# EAGLE design SparkFun_MicroMod_GNSS_Function_Board_ZED-F9P (EAGLE 9.6.2)
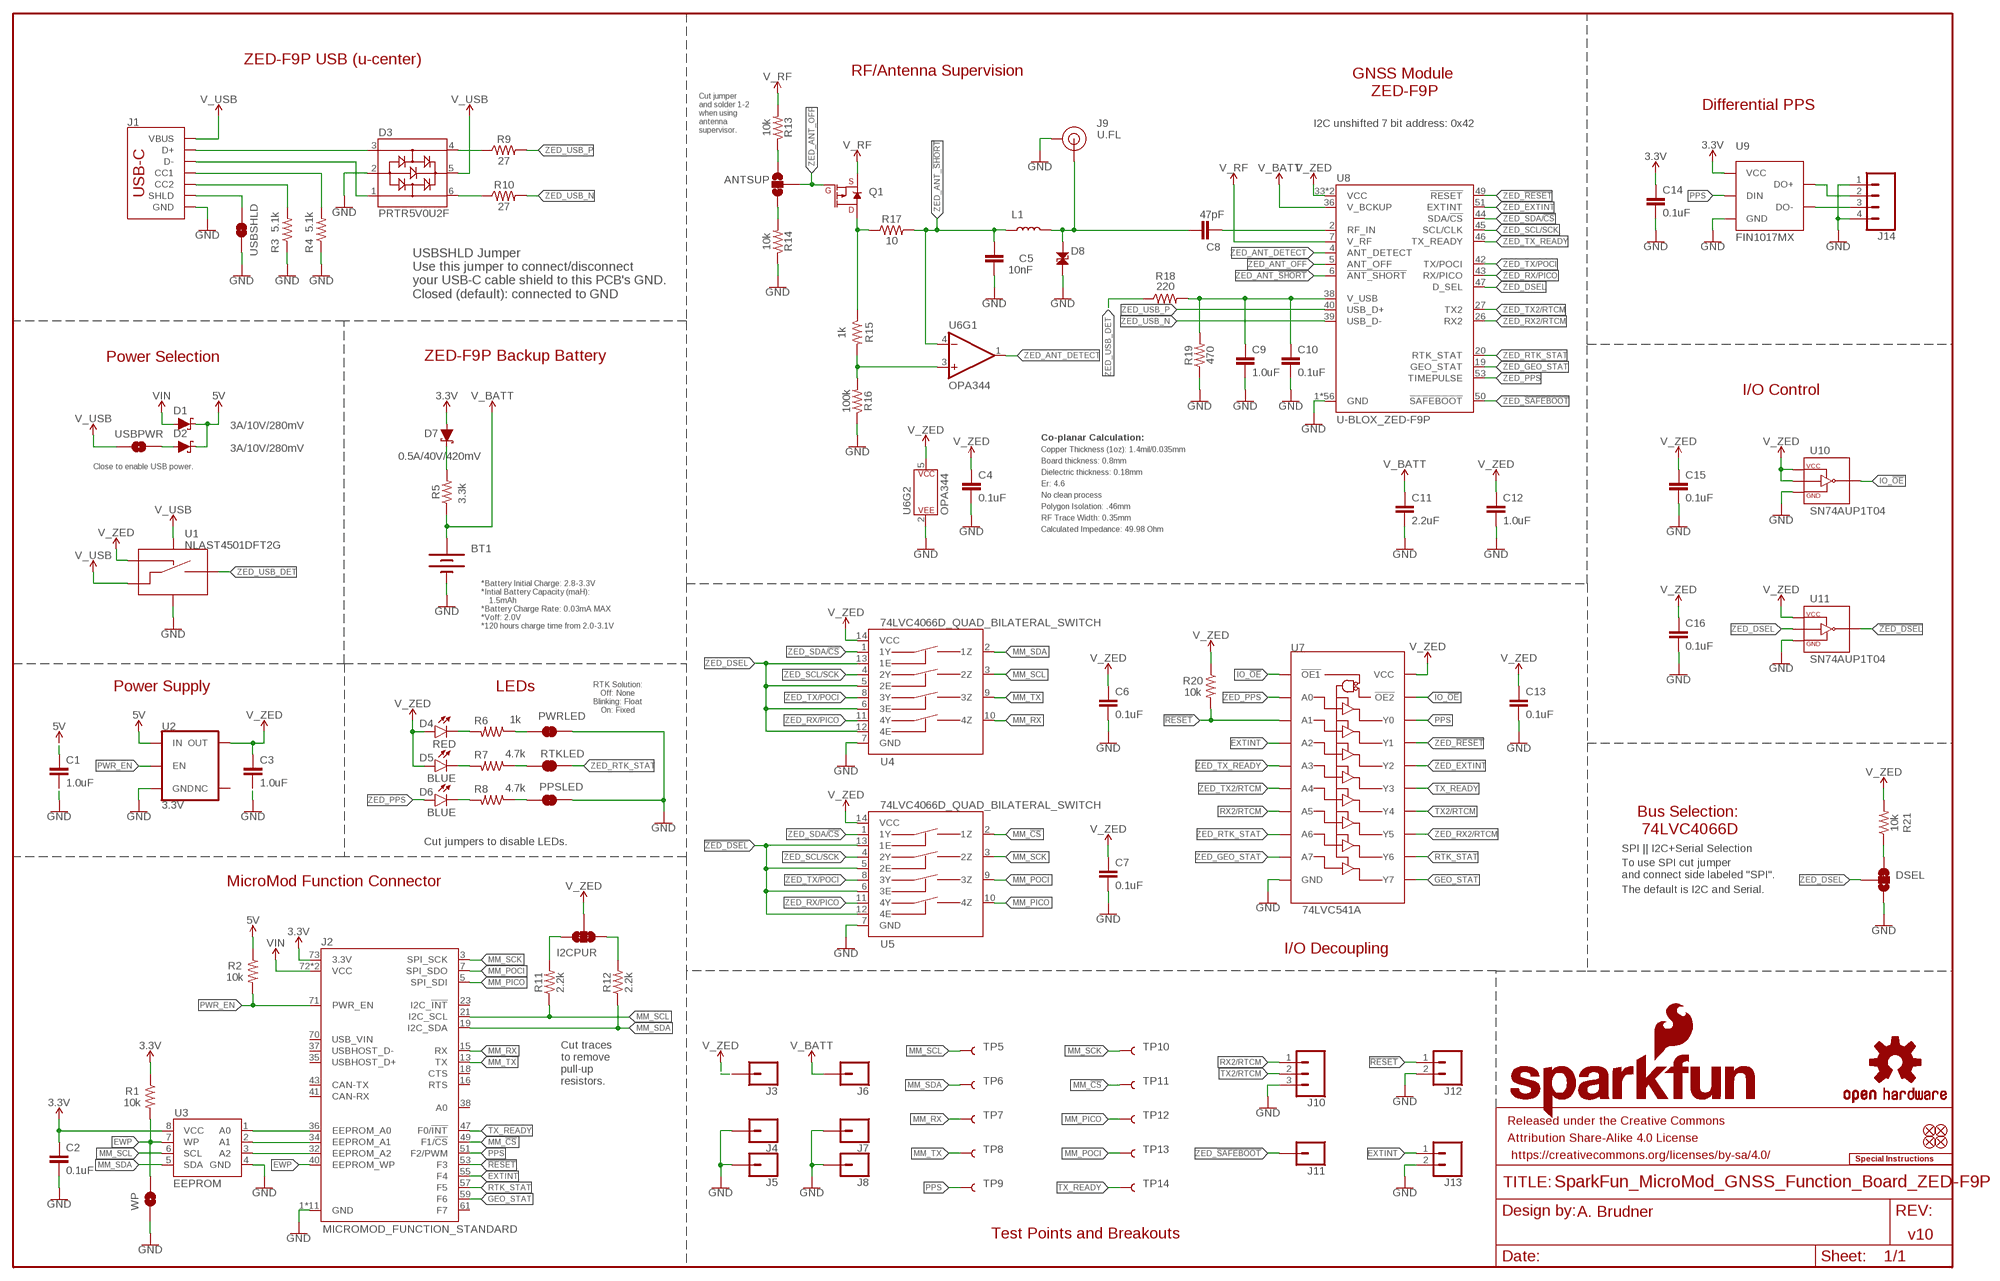
[diagram p0: schematic, sheet 1]

## Parts
ANTSUP  JUMPER-SMT_3_1-NC_TRACE_SILK  [SMT-JUMPER_3_1-NC_TRACE_SILK]
BT1  RELOWABLE_BATTERY_MS421R  [MS421R_IV03E]
C1  1.0uF  1.0UF-0402T-16V-10%  [0402-TIGHT]
C2  0.1uF  0.1UF-0402T-16V-10%  [0402-TIGHT]
C3  1.0uF  1.0UF-0402T-16V-10%  [0402-TIGHT]
C4  0.1uF  0.1UF-0402T-16V-10%  [0402-TIGHT]
C5  10nF  10NF-0402T-25V-10%-X7R-WE  [0402-TIGHT]
C6  0.1uF  0.1UF-0402T-16V-10%  [0402-TIGHT]
C7  0.1uF  0.1UF-0402T-16V-10%  [0402-TIGHT]
C8  47pF  CBR04C470J5GAC  [0402-TIGHT]
C9  1.0uF  1.0UF-0402T-16V-10%  [0402-TIGHT]
C10  0.1uF  0.1UF-0402T-16V-10%  [0402-TIGHT]
C11  2.2uF  2.2UF-0402_TIGHT-10V-10%-X5R  [0402-TIGHT]
C12  1.0uF  1.0UF-0402T-16V-10%  [0402-TIGHT]
C13  0.1uF  0.1UF-0402T-16V-10%  [0402-TIGHT]
C14  0.1uF  0.1UF-0402T-16V-10%  [0402-TIGHT]
C15  0.1uF  0.1UF-0402T-16V-10%  [0402-TIGHT]
C16  0.1uF  0.1UF-0402T-16V-10%  [0402-TIGHT]
D1  3A/10V/280mV  DIODE-SCHOTTKY-BAT60A  [SOD-323]
D2  3A/10V/280mV  DIODE-SCHOTTKY-BAT60A  [SOD-323]
D3  PRTR5V0U2F  [SOT886]
D4  RED  LED-RED0603  [LED-0603]
D5  BLUE  LED-BLUE0603  [LED-0603]
D6  BLUE  LED-BLUE0603  [LED-0603]
D7  0.5A/40V/420mV  DIODE-SCHOTTKY-PMEG4005EJ  [SOD-323]
D8  PESD0402-0402T  [0402-TIGHT]
DSEL  JUMPER-SMT_3_1-NC_TRACE_SILK  [SMT-JUMPER_3_1-NC_TRACE_SILK]
FD1  FIDUCIALUFIDUCIAL  [FIDUCIAL-MICRO]
FD2  FIDUCIALUFIDUCIAL  [FIDUCIAL-MICRO]
FD3  FIDUCIALUFIDUCIAL  [FIDUCIAL-MICRO]
FD4  FIDUCIALUFIDUCIAL  [FIDUCIAL-MICRO]
FRAME1  FRAME-LEDGER  [CREATIVE_COMMONS]
I2CPUR  JUMPER-SMT_3_2-NC_TRACE_SILK  [SMT-JUMPER_3_2-NC_TRACE_SILK]
J1  USB Female Type C Connector  USB_C_4-LAYER-ISOLATED  [USB-C-16P-4LAYER-ISOLATED]
J2  MICROMOD_FUNCTION_STANDARD  [M.2-CARD-E-22_FUNCTION_STANDARD]
J3  CONN_01PTH_NO_SILK_YES_STOP  [1X01_NO_SILK]
J4  CONN_01PTH_NO_SILK_YES_STOP  [1X01_NO_SILK]
J5  CONN_01PTH_NO_SILK_YES_STOP  [1X01_NO_SILK]
J6  CONN_01PTH_NO_SILK_SMALL  [1X01_SMALL]
J7  CONN_01PTH_NO_SILK_YES_STOP  [1X01_NO_SILK]
J8  CONN_01PTH_NO_SILK_YES_STOP  [1X01_NO_SILK]
J9  U.FL  U.FL2PIN  [U.FL]
J10  455-1750-1-ND  CONN_031X03_NO_SILK  [1X03_NO_SILK]
J11  CONN_01PTH_NO_SILK_YES_STOP  [1X01_NO_SILK]
J12  CONN_021X02_NO_SILK  [1X02_NO_SILK]
J13  CONN_021X02_NO_SILK  [1X02_NO_SILK]
J14  CONN_041X04_NO_SILK  [1X04_NO_SILK]
L1  150nH  LQW15AWR15J80D  [0402_MURATA]
LOGO1  SFE_LOGO_NAME_FLAMEBLANK  [BLANK]
LOGO2  SPECIAL_INSTRUCTIONS-ORDERING  [ORDERING_INSTRUCTIONS]
LOGO3  OSHW-LOGOMINI  [OSHW-LOGO-MINI]
PPSLED  JUMPER-SMT_2_NC_TRACE_SILK  [SMT-JUMPER_2_NC_TRACE_SILK]
PWRLED  JUMPER-SMT_2_NC_TRACE_SILK  [SMT-JUMPER_2_NC_TRACE_SILK]
Q1  DMP21D0UT-7  [SOT523]
R1  10k  10KOHM-0402T-1/16W-1%  [0402-TIGHT]
R2  10k  10KOHM-0402T-1/16W-1%  [0402-TIGHT]
R3  5.1k  5.1KOHM-0402T-1/16W-1%  [0402-TIGHT]
R4  5.1k  5.1KOHM-0402T-1/16W-1%  [0402-TIGHT]
R5  3.3K  3.3KOHM-0402T-1/16W-1%  [0402-TIGHT]
R6  1k  1KOHM-0402T-1/16W-1%  [0402-TIGHT]
R7  4.7k  4.7KOHM-0402T-1/16W-1%  [0402-TIGHT]
R8  4.7k  4.7KOHM-0402T-1/16W-1%  [0402-TIGHT]
R9  27  27OHM  [0402-TIGHT]
R10  27  27OHM  [0402-TIGHT]
R11  2.2k  2.2KOHM-0402T-1/16W-1%  [0402-TIGHT]
R12  2.2k  2.2KOHM-0402T-1/16W-1%  [0402-TIGHT]
R13  10k  10KOHM-0402T-1/16W-1%  [0402-TIGHT]
R14  10k  10KOHM-0402T-1/16W-1%  [0402-TIGHT]
R15  1k  1KOHM-0402T-1/16W-1%  [0402-TIGHT]
R16  100k  100KOHM-0402T-1/16W-1%  [0402-TIGHT]
R17  10  10OHM-0603-1/10W-1%  [0603]
R18  220  220OHM-0402-TIGHT-1/16W-1%  [0402-TIGHT]
R19  470  470OHM-0402-TIGHT-1/16W-1%  [0402-TIGHT]
R20  10k  10KOHM-0402T-1/16W-1%  [0402-TIGHT]
R21  10k  10KOHM-0402T-1/16W-1%  [0402-TIGHT]
RTKLED  JUMPER-SMT_2_NC_TRACE_SILK  [SMT-JUMPER_2_NC_TRACE_SILK]
TP5  TEST-POINT3  [PAD.03X.03]
TP6  TEST-POINT3  [PAD.03X.03]
TP7  TEST-POINT3  [PAD.03X.03]
TP8  TEST-POINT3  [PAD.03X.03]
TP9  TEST-POINT3  [PAD.03X.03]
TP10  TEST-POINT3  [PAD.03X.03]
TP11  TEST-POINT3  [PAD.03X.03]
TP12  TEST-POINT3  [PAD.03X.03]
TP13  TEST-POINT3  [PAD.03X.03]
TP14  TEST-POINT3  [PAD.03X.03]
U1  NLAST4501DFT2G  [SOT353]
U2  3.3V  V_REG_AP2112K-3.3V  [SOT23-5]
U3  EEPROM  EEPROM-I2C512K  [SO08]
U4  74LVC4066D_QUAD_BILATERAL_SWITCH  [SO14]
U5  74LVC4066D_QUAD_BILATERAL_SWITCH  [SO14]
U6  OPA344  [SOT23-5]
U7  74LVC541A  74LVC541ABQ  [DHVQFN20]
U8  U-BLOX_ZED-F9P  [ZED-F9P]
U9  FIN1017MX  [SO08]
U10  SN74AUP1T04  SN74AUP1T04DCK  [SC-70-5_DCK]
U11  SN74AUP1T04  SN74AUP1T04DCK  [SC-70-5_DCK]
USBPWR  JUMPER-SMT_2_NO_SILK  [SMT-JUMPER_2_NO_SILK]
USBSHLD  JUMPER-SMT_2_NC_TRACE_SILK  [SMT-JUMPER_2_NC_TRACE_SILK]
WP  JUMPER-SMT_2_NO_SILK  [SMT-JUMPER_2_NO_SILK]

## Nets
3.3V [3.3V]: C2.1 C14.1 D7.A J2.73(3.3V) R1.1 U3.8(VCC) U9.1(VCC)
5V [5V]: C1.1 D1.C D2.C R2.1 U2.1(IN)
!RESET! [DIGITAL]: J2.53(F3) J12.1 R20.2 U7.3(A1)
!ZED_DSEL! [ZED_DIG]: U5.5(2E) U5.6(3E) U5.12(4E) U5.13(1E) U11.4(Y)
A0 [DIGITAL]: J2.36(EEPROM_A0) U3.1(A0)
A1 [DIGITAL]: J2.34(EEPROM_A1) U3.2(A1)
A2 [DIGITAL]: J2.32(EEPROM_A2) U3.3(A2)
EWP [DIGITAL]: J2.40(EEPROM_WP) R1.2 U3.7(WP) WP.2
EXTINT [DIGITAL]: J2.55(F4) J13.1 U7.4(A2)
GEO_STAT [DIGITAL]: J2.59(F6) U7.11(Y7)
GND [GND]: BT1.- C1.2 C2.2 C3.2 C4.2 C5.2 C6.2 C7.2 C9.2 C10.2 C11.2 C12.2 C13.2 C14.2 C15.2 C16.2 D3.2 D8.2 DSEL.1 J1.GND J1.GND2(GND) J2.1(GND) J2.33(GND) J2.39(GND) J2.45(GND) J2.75(GND) J2.GND1(GND) J2.GND2(GND) J2.GND3(GND) J2.GND4(GND) J2.GND5(GND) J2.GND6(GND) J4.1 J5.1 J7.1 J8.1 J9.1(GND) J9.2(GND) J10.3 J12.2 J13.2 J14.1 J14.4 PPSLED.1 PWRLED.2 R3.1 R4.1 R14.1 R16.1 R19.1 U1.3(GND) U2.2(GND) U3.4(GND) U4.7(GND) U5.7(GND) U6.2(P$V-) U7.10(GND) U7.EPAD(GND) U8.1(GND) U8.3(GND) U8.12(GND) U8.14(GND) U8.32(GND) U8.37(GND) U8.41(GND) U8.48(GND) U8.55(GND) U8.56(GND) U8.57(GND) U8.58(GND) U8.59(GND) U8.60(GND) U8.61(GND) U8.62(GND) U8.63(GND) U8.64(GND) U8.65(GND) U8.66(GND) U8.67(GND) U8.68(GND) U8.69(GND) U8.70(GND) U8.71(GND) U8.72(GND) U8.73(GND) U8.74(GND) U8.75(GND) U8.76(GND) U8.77(GND) U8.78(GND) U8.79(GND) U8.80(GND) U8.81(GND) U8.82(GND) U8.83(GND) U8.84(GND) U8.85(GND) U8.86(GND) U8.87(GND) U8.88(GND) U8.89(GND) U8.90(GND) U8.91(GND) U8.92(GND) U8.93(GND) U8.94(GND) U8.95(GND) U8.96(GND) U8.97(GND) U8.98(GND) U8.99(GND) U8.100(GND) U8.101(GND) U8.102(GND) U9.4(GND) U10.3(GND) U11.3(GND) USBSHLD.2 WP.1
IO_!OE! [DIGITAL]: U7.1(!OE1!) U7.19(!OE2!) U10.4(Y)
MM_!CS! [DIGITAL]: J2.49(F1/!CS!) TP11.1 U5.2(1Z)
MM_PICO [DIGITAL]: J2.5(SPI_SDI) TP12.1 U5.10(4Z)
MM_POCI [DIGITAL]: J2.7(SPI_SDO) TP13.1 U5.9(3Z)
MM_RX [DIGITAL]: J2.15(RX) TP7.1 U4.10(4Z)
MM_SCK [DIGITAL]: J2.3(SPI_SCK) TP10.1 U5.3(2Z)
MM_SCL [DIGITAL]: J2.21(I2C_SCL) R11.1 TP5.1 U3.6(SCL) U4.3(2Z)
MM_SDA [DIGITAL]: J2.19(I2C_SDA) R12.1 TP6.1 U3.5(SDA) U4.2(1Z)
MM_TX [DIGITAL]: J2.13(TX) TP8.1 U4.9(3Z)
N$1: ANTSUP.1 R13.1
N$2: ANTSUP.3 R14.2
N$3: J1.B5(CC2) R3.2
N$4: J1.A5(CC1) R4.2
N$5: DSEL.3 R21.1
N$6: I2CPUR.3 R11.2
N$7 [RF_IN]: C8.1 D8.1 J9.FEED(SIGNAL) L1.2
N$8: R7.1 RTKLED.2
N$9: I2CPUR.1 R12.2
N$13: Q1.1(D) R15.1 R17.1
N$14 [3.3V]: C9.1 C10.1 R18.2 R19.2 U8.38(V_USB)
N$16 [5V]: D2.A USBPWR.2
N$26: PWRLED.1 R6.1
N$27: PPSLED.2 R8.1
N$28: D6.C R8.2
N$29: D5.C R7.2
N$30: D4.C R6.2
N$32 [3.3V]: D7.C R5.2
N$48: R15.2 R16.2 U6.3(+IN)
PPS [DIGITAL]: J2.51(F2/PWM) TP9.1 U7.18(Y0) U9.2(DIN)
PPS_DIFF_N [PPS_DIFF]: J14.3 U9.8(DO-)
PPS_DIFF_P [PPS_DIFF]: J14.2 U9.7(DO+)
PWR_EN [DIGITAL]: J2.71(PWR_EN) R2.2 U2.3(EN)
RF_IN [RF_IN]: C8.2 U8.2(RF_IN)
RTK_STAT [DIGITAL]: J2.57(F5) U7.12(Y6)
RX2/RTCM [DIGITAL]: J10.1 U7.7(A5)
SHLD: J1.SHLD1(SHLD) J1.SHLD2(SHLD) J1.SHLD3(SHLD) J1.SHLD4(SHLD) J1.SHLD5(SHLD) J1.SHLD6(SHLD) J1.SHLD7(SHLD) J1.SHLD8(SHLD) USBSHLD.1
TX2/RTCM [DIGITAL]: J10.2 U7.14(Y4)
TX_READY [DIGITAL]: J2.47(F0/!INT!) TP14.1 U7.15(Y3)
USB_N [USB_DIFF]: D3.6 R10.1
USB_P [USB_DIFF]: D3.4 R9.1
USBC_N [USB_DIFF]: D3.1 J1.A7(D-) J1.B7(D-)
USBC_P [USB_DIFF]: D3.3 J1.A6(D+) J1.B6(D+)
V_BATT [5V]: BT1.+ C11.1 J6.P$1 R5.1 U8.36(V_BCKUP)
V_RF [V_RF]: Q1.2(S) R13.2 U8.7(V_RF)
V_USB [5V]: D3.5 J1.VBUS1(VBUS) J1.VBUS2(VBUS) U1.1(COM) U1.5(VCC) USBPWR.1
V_ZED [V_ZED]: C3.1 C4.1 C6.1 C7.1 C12.1 C13.1 C15.1 C16.1 D4.A D5.A I2CPUR.2 J3.1 R20.1 R21.2 U1.4(EN) U2.5(OUT) U4.14(VCC) U5.14(VCC) U6.5(P$V+) U7.20(VCC) U8.33(VCC) U8.34(VCC) U10.2(A) U10.5(VCC) U11.5(VCC)
VIN [5V]: D1.A J2.72(VCC) J2.74(VCC)
ZED_!RESET! [ZED_DIG]: U7.17(Y1) U8.49(!RESET!)
ZED_!SAFEBOOT! [ZED_DIG]: J11.1 U8.50(!SAFEBOOT!)
ZED_ANT_!SHORT! [ZED_DIG]: C5.1 L1.1 R17.2 U6.4(-IN) U8.6(!ANT_SHORT!)
ZED_ANT_DETECT [ZED_DIG]: U6.1(OUT) U8.4(ANT_DETECT)
ZED_ANT_OFF [ZED_DIG]: ANTSUP.2 Q1.3(G) U8.5(ANT_OFF)
ZED_DSEL [ZED_DIG]: DSEL.2 U4.5(2E) U4.6(3E) U4.12(4E) U4.13(1E) U8.47(D_SEL) U11.2(A)
ZED_EXTINT [ZED_DIG]: U7.16(Y2) U8.51(EXTINT)
ZED_GEO_STAT [ZED_DIG]: U7.9(A7) U8.19(GEO_STAT)
ZED_PPS [ZED_DIG]: D6.A U7.2(A0) U8.53(TIMEPULSE)
ZED_RTK_STAT [ZED_DIG]: RTKLED.1 U7.8(A6) U8.20(RTK_STAT)
ZED_RX2/RTCM [ZED_DIG]: U7.13(Y5) U8.26(RX2)
ZED_RX/PICO [ZED_DIG]: U4.11(4Y) U5.11(4Y) U8.43(RX/PICO)
ZED_SCL/SCK [ZED_DIG]: U4.4(2Y) U5.4(2Y) U8.45(SCL/CLK)
ZED_SDA/!CS! [ZED_DIG]: U4.1(1Y) U5.1(1Y) U8.44(SDA/!CS!)
ZED_TX2/RTCM [ZED_DIG]: U7.6(A4) U8.27(TX2)
ZED_TX/POCI [ZED_DIG]: U4.8(3Y) U5.8(3Y) U8.42(TX/POCI)
ZED_TX_READY [ZED_DIG]: U7.5(A3) U8.46(TX_READY)
ZED_USB_DET: R18.1 U1.2(NO)
ZED_USB_N [USB_DIFF]: R10.2 U8.39(USB_D-)
ZED_USB_P [USB_DIFF]: R9.2 U8.40(USB_D+)
Unconnected: J2.16(RTS) J2.18(CTS) J2.23(I2C_!INT!) J2.35(USBHOST_D+) J2.37(USBHOST_D-) J2.38(A0) J2.41(CAN-RX) J2.43(CAN-TX) J2.61(F7) J2.70(USB_VIN) U2.4(NC)

## Notes on the sheet
- ZED-F9P USB (u-center)
- RF/Antenna Supervision
- GNSS Module 
  ZED-F9P
- Differential PPS
- I2C unshifted 7 bit address: 0x42
- Cut jumper 
  and solder 1-2 
  when using 
  antenna 
  supervisor.
- USBSHLD Jumper
  Use this jumper to connect/disconnect
  your USB-C cable shield to this PCB's GND.
  Closed (default): connected to GND
- Power Selection | ZED-F9P Backup Battery
- I/O Control
- Co-planar Calculation:
- Copper Thickness (1oz): 1.4mil/0.035mm
- Board thickness: 0.8mm
- Close to enable USB power.
- Dielectric thickness: 0.18mm
- Er: 4.6
- No clean process
- Polygon Isolation: .46mm
- RF Trace Width: 0.35mm
- Calculated Impedance: 49.98 Ohm
- *Battery Initial Charge: 2.8-3.3V
  *Intial Battery Capacity (maH): 
      1.5mAh
  *Battery Charge Rate: 0.03mA MAX
  *Voff: 2.0V
  *120 hours charge time from 2.0-3.1V
- Power Supply | LEDs
- RTK Solution:
  Off: None
  Blinking: Float
  On: Fixed
- Bus Selection: 
  74LVC4066D
- Cut jumpers to disable LEDs.
- SPI || I2C+Serial Selection
- To use SPI cut jumper
  and connect side labeled "SPI".
- MicroMod Function Connector
- The default is I2C and Serial.
- I/O Decoupling
- Cut traces 
  to remove 
  pull-up 
  resistors.
- A. Brudner
- Test Points and Breakouts
- v10

## Library data of the parts
ANTSUP DSEL = SparkFun-Jumpers:JUMPER-SMT_3_1-NC_TRACE: Normally closed trace jumper (1 of 2 connections) This jumper has a trace between two pads so it's normally closed (NC). The other connection is normally open (NO). Use a razor knife to open the connection. For best results follow the IPC guidelines for cutting traces: Cutout at least 0.063 mm (0.005 in). Remove all loose material to clean up the cut area. Seal the cut with an approved epoxy. Reapply solder to reclose the connection, or to close the NO connection.
BT1 = SparkFun-Batteries:RELOWABLE_BATTERY: SEIKO Reflowable Lithium Batteries; PROD_ID: BAT-16685
C1 C3 C9 C12 = SparkFun-Capacitors:1.0UF: 1µF ceramic capacitors A capacitor is a passive two-terminal electrical component used to store electrical energy temporarily in an electric field.; PROD_ID: CAP-12417
C2 C4 C6 C7 C10 C13-C16 = SparkFun-Capacitors:0.1UF: 0.1µF ceramic capacitors A capacitor is a passive two-terminal electrical component used to store electrical energy temporarily in an electric field.; PROD_ID: CAP-12416
C5 = SparkFun-Capacitors:10NF: 0.01uF/10nF/10,000pF ceramic capacitors A capacitor is a passive two-terminal electrical component used to store electrical energy temporarily in an electric field. CAP-09321; PROD_ID: CAP-16508
C8 = SparkFun_MicroMod_GNSS_Function_Board_ZED-F9P:CBR04C470J5GAC: Kemet CBR04C470J5GAC - 47pF 5% 50V 0402 Capacitor KEMET’s HiQ CBR RF Capacitor Series features a copper electrode BME (Base Metal Electrode) system that offers ultra-low ESR and High Q in the VHF, UHF, and microwave frequency bands. Low ESR allows for higher RF currents which are ideal for applications such as cellular base stations and telecommunication networks. CBR Series capacitors exhibit no change in capacitance with respect to time and voltage, and boast a negligible change in capacitance with reference to ambient temperature. SparkFun Products: SparkFun MicroMod Function Board ZED-F9P; CAPACITANCE: 47pF; PROD_ID: CAP-16699; TOLERANCE: 5%; VOLTAGE: 50V
C11 = SparkFun-Capacitors:2.2UF: 2.2µF ceramic capacitors A capacitor is a passive two-terminal electrical component used to store electrical energy temporarily in an electric field.; PROD_ID: CAP-14232
D1 D2 = SparkFun-DiscreteSemi:DIODE-SCHOTTKY: Schottky diode A Schottky diode is a semiconductor diode which has a low forward voltage drop and a very fast switching action.; PROD_ID: DIO-14072
D3 = SparkFun-IC-Power:PRTR5V0U2: A small ESD protection device. Most commonly used on USB D+/D- signals to protect large, expensive, or especially sensitive USB enabled devices.; PROD_ID: DIO-14084
D4 = SparkFun-LED:LED-RED: Red SMD LED Used in manufacturing of most products at SparkFun Packages: 0603 - SMD 0603 package [Product Link] <http://docs.avagotech.com/docs/AV02-0551EN> 0603 SMART - SMD 0603 SMART package ( more efficient and expensive)[Product Link] <http://www.osram-os.com/Graphics/XPic2/00077099_0.pdf> 1206 - SMD1206 package [Product Link] <https://www.sparkfun.com/datasheets/DevTools/LilyPad/Q150OVS4.pdff> SparkFun Products: Pro Mini 328 -5V <https://www.sparkfun.com/products/821> RedBoard <https://www.sparkfun.com/products/12757> IOIO-OTG <https://www.sparkfun.com/products/13613>; PROD_ID: DIO-00819
D5 D6 = SparkFun-LED:LED-BLUE: Blue SMD LED Used in manufacturing of various products at SparkFun Packages: 0603 - SMD 0603 package [Product Link] <http://www.digikey.com/product-detail/en/SMLE12BC7TT86/511-1589-2-ND/1641808> 1206 - SMD1206 package [Product Link] <http://www.digikey.com/product-detail/en/lite-on-inc/LTST-C150TBKT/160-1643-1-ND/573584> SparkFun Products: ESP8266 Thing-Dev Board <https://www.sparkfun.com/products/13711> RedBoard <https://www.sparkfun.com/products/12757>; PROD_ID: DIO-08575
D7 = SparkFun-DiscreteSemi:DIODE-SCHOTTKY: Schottky diode A Schottky diode is a semiconductor diode which has a low forward voltage drop and a very fast switching action.; PROD_ID: DIO-10955
D8 = SparkFun-DiscreteSemi:PESD0402: ESD protection diode PESD is used to protect a signal line from ESD.; PROD_ID: DIO-15359
FD1-FD4 = SparkFun-Aesthetics:FIDUCIAL: Fiducial Alignment Points Point-of-reference for pick-and-place machines and other optical instruments.
FRAME1 = SparkFun-Aesthetics:FRAME-LEDGER: Schematic Frame - Ledger Standard 11x14 US Ledger frame
I2CPUR = SparkFun-Jumpers:JUMPER-SMT_3_2-NC_TRACE: Normally closed trace jumper (2 of 2 connections) This jumper has a trace between all three pads so they are normally closed (NC). Use a razor knife to open the connection(s). For best results follow the IPC guidelines for cutting traces: Cutout at least 0.063 mm (0.005 in). Remove all loose material to clean up the cut area. Seal the cut with an approved epoxy. Reapply solder to reclose the connection(s).
J1 = SparkFun-Connectors:USB_C: USB Type C 16Pin Connector Super Speed pins not available on the 16-pin purely SMD connector so this part is best for USB 2.0 implementations. D1 and D2 are tied together enabling D+/- no matter which way the cable is plugged into the connector. The two channel configuration pins (CC1/2) are exposed. These are normally connected to ground via 5.1k resistors but can be reconfigured for high current/high power applications. **4-LAYER BOARD WARNING!!** If designing 4-layer board, make sure to select the variant _4-LAYER-ISOLATED. The linked footprint (USB-C-16-4LAYER-ISOLATED) includes some very necessary cutout polygons in the inner layers (2 and 15). This prevents the PTH mounting shield legs on the USB connector from electrically connecting any other polygons on the inner layers (usually VCC and GND).; PROD_ID: CONN-14122
J2 = SparkFun-MicroMod:MICROMOD_FUNCTION: MicroMod Connector Description: A card edge connector and mating PCB connector to allow various MicroMod Processor Boards to be coupled with various carrier boards of different capabilities. Based on the M.2 standard.
J3-J8 J11 = SparkFun-Connectors:CONN_01: Single connection point. Often used as Generic Header-pin footprint for 0.1 inch spaced/style header connections On any of the 0.1 inch spaced packages, you can populate with these: Break Away Headers - Straight <https://www.sparkfun.com/products/116> (PRT-00116) Break Away Male Headers - Right Angle <https://www.sparkfun.com/products/553> (PRT-00553) Female Headers <https://www.sparkfun.com/products/115> (PRT-00115) Break Away Headers - Machine Pin <https://www.sparkfun.com/products/117> (PRT-00117) Break Away Female Headers - Swiss Machine Pin <https://www.sparkfun.com/products/743> (PRT-00743) This device is also useful as a general connection point to wire up your design to another part of your project. Our various solder wires solder well into these plated through hole pads. Hook-Up Wire - Assortment (Stranded, 22 AWG) <https://www.sparkfun.com/products/11375> (PRT-11375) Hook-Up Wire - Assortment (Solid Core, 22 AWG) <https://www.sparkfun.com/products/11367> (PRT-11367) View the entire wire category on our website here <https://www.sparkfun.com/categories/141> Special notes: SMTSO-256-ET is a "flush mount" nut for a 4-40 screw. We mostly use this on specialty testbeds; it is a nice way to connect hardware to your PCB at an adjustable hieght. Also note, the SNAP packages are for using a snappable style connector. We sell a baggie of snaps and they are also used on two LilyPad designs: Snap Assortment - 30 pack (male and female) <https://www.sparkfun.com/products/11347> (DEV-11347) LilyPad Arduino SimpleSnap <https://www.sparkfun.com/products/10941> (DEV-10941) LilyPad SimpleSnap Protoboard <https://www.sparkfun.com/products/10940> (DEV-10940)
J9 = SparkFun-Connectors:U.FL2PIN: SMD Antenna Connector - U.FL 2mm height, 3.0mm x 3.0mm receptacle size. SparkFun Products: SparkFun WiFi Shield - ESP8266 <https://www.sparkfun.com/products/13287> SparkFun ESP8266 Thing <https://www.sparkfun.com/products/13231> SparkFun MiniGen - Pro Mini Signal Generator Shield <https://www.sparkfun.com/products/11420>; PROD_ID: CONN-09193; SF_ID: WRL-09144
J10 = SparkFun-Connectors:CONN_03: Multi connection point. Often used as Generic Header-pin footprint for 0.1 inch spaced/style header connections On any of the 0.1 inch spaced packages, you can populate with these: Break Away Headers - Straight <https://www.sparkfun.com/products/116> (PRT-00116) Break Away Male Headers - Right Angle <https://www.sparkfun.com/products/553> (PRT-00553) Female Headers <https://www.sparkfun.com/products/115> (PRT-00115) Break Away Headers - Machine Pin <https://www.sparkfun.com/products/117> (PRT-00117) Break Away Female Headers - Swiss Machine Pin <https://www.sparkfun.com/products/743> (PRT-00743) Stackable Header - 3 Pin (Female, 0.1") <https://www.sparkfun.com/products/13875> (PRT-13875) For SCREWTERMINALS and SPRING TERMINALS visit here: Screw Terimnals on SparkFun.com <https://www.sparkfun.com/search/results?term=Screw+Terminals> (5mm/3.5mm/2.54mm spacing) This device is also useful as a general connection point to wire up your design to another part of your project. Our various solder wires solder well into these plated through hole pads. Hook-Up Wire - Assortment (Stranded, 22 AWG) <https://www.sparkfun.com/products/11375> (PRT-11375) Hook-Up Wire - Assortment (Solid Core, 22 AWG) <https://www.sparkfun.com/products/11367> (PRT-11367) View the entire wire category on our website here <https://www.sparkfun.com/categories/141> Special notes: Molex polarized connector foot print use with SKU : PRT-08232 with associated crimp pins and housings.
J12 J13 = SparkFun-Connectors:CONN_02: Multi connection point. Often used as Generic Header-pin footprint for 0.1 inch spaced/style header connections On any of the 0.1 inch spaced packages, you can populate with these: Break Away Headers - Straight <https://www.sparkfun.com/products/116> (PRT-00116) Break Away Male Headers - Right Angle <https://www.sparkfun.com/products/553> (PRT-00553) Female Headers <https://www.sparkfun.com/products/115> (PRT-00115) Break Away Headers - Machine Pin <https://www.sparkfun.com/products/117> (PRT-00117) Break Away Female Headers - Swiss Machine Pin <https://www.sparkfun.com/products/743> (PRT-00743) For SCREWTERMINALS and SPRING TERMINALS visit here: Screw Terimnals on SparkFun.com <https://www.sparkfun.com/search/results?term=Screw+Terminals> (5mm/3.5mm/2.54mm spacing) This device is also useful as a general connection point to wire up your design to another part of your project. Our various solder wires solder well into these plated through hole pads. Hook-Up Wire - Assortment (Stranded, 22 AWG) <https://www.sparkfun.com/products/11375> (PRT-11375) Hook-Up Wire - Assortment (Solid Core, 22 AWG) <https://www.sparkfun.com/products/11367> (PRT-11367) View the entire wire category on our website here <https://www.sparkfun.com/categories/141> Special notes: Molex polarized connector foot print use with: PRT-08233 with associated crimp pins and housings. 2.54_SCREWTERM for use with PRT-10571. 3.5mm Screw Terminal footprints for PRT-08084 5mm Screw Terminal footprints for use with PRT-08432
J14 = SparkFun-Connectors:CONN_04: Multi connection point. Often used as Generic Header-pin footprint for 0.1 inch spaced/style header connections On any of the 0.1 inch spaced packages, you can populate with these: Break Away Headers - Straight <https://www.sparkfun.com/products/116> (PRT-00116) Break Away Male Headers - Right Angle <https://www.sparkfun.com/products/553> (PRT-00553) Female Headers <https://www.sparkfun.com/products/115> (PRT-00115) Break Away Headers - Machine Pin <https://www.sparkfun.com/products/117> (PRT-00117) Break Away Female Headers - Swiss Machine Pin <https://www.sparkfun.com/products/743> (PRT-00743) For SCREWTERMINALS and SPRING TERMINALS visit here: Screw Terimnals on SparkFun.com <https://www.sparkfun.com/search/results?term=Screw+Terminals> (5mm/3.5mm/2.54mm spacing) This device is also useful as a general connection point to wire up your design to another part of your project. Our various solder wires solder well into these plated through hole pads. Hook-Up Wire - Assortment (Stranded, 22 AWG) <https://www.sparkfun.com/products/11375> (PRT-11375) Hook-Up Wire - Assortment (Solid Core, 22 AWG) <https://www.sparkfun.com/products/11367> (PRT-11367) View the entire wire category on our website here <https://www.sparkfun.com/categories/141> Special notes: Molex polarized connector foot print use with SKU : PRT-08231 with associated crimp pins and housings. 1MM SMD Version SKU: PRT-10208; PROD_ID: CONN-09696
L1 = SparkFun_MicroMod_GNSS_Function_Board_ZED-F9P:LQW15AWR15J80D: Murata LQW15AW_08 series- 0402 Chip Inductors Chip Inductor SparkFun Products: SparkFun MicroMod u-blox ZED-F9P Function Board; CURRENT: 280mA; DCRESISTANCE: 1.71Ohm; PROD_ID: NDUC-16702
LOGO1 = SparkFun-Aesthetics:SFE_LOGO_NAME_FLAME: SparkFun Font Logo w/ Flame This is the SparkFun full logo. The logo on the schematic will always be the same size; the package variant is the height of the flame part of the logo. Default layer for the logo on the board is tSilk.
LOGO2 = SparkFun-Aesthetics:SPECIAL_INSTRUCTIONS: Special Ordering/Production Instructions Alert Symbol for special PCB ordering instructions or unique production process warnings. Ordering Instructions Production Instructions Types of information that should be added to box: Copper weight Soldermask color Silk color PCB thickness Number of layers PCB Standard: 1.6mm FR4 1 oz copper immersion silver plating red soldermask white silkscreen Types of information that should be added to box: Special wash requirements Depaneling instructions Humidification Glue curing Default text settings: 0.07 inch 9% ratio 50% line distance
LOGO3 = SparkFun-Aesthetics:OSHW-LOGO: Open-Source Hardware (OSHW) Logo This logo indicates the piece of hardware it is found on incorporates a OSHW license and/or adheres to the definition of open source hardware found here: http://freedomdefined.org/OSHW
PPSLED PWRLED RTKLED USBSHLD = SparkFun-Jumpers:JUMPER-SMT_2_NC_TRACE: Normally closed trace jumper This jumper has a trace between two pads so it's normally closed (NC). Use a razor knife to open the connection. For best results follow the IPC guidelines for cutting traces: Cutout at least 0.063 mm (0.005 in). Remove all loose material to clean up the cut area. Seal the cut with an approved epoxy. Reapply solder to reclose the connection.
Q1 = SparkFun_MicroMod_GNSS_Function_Board_ZED-F9P:DMP21D0UT: Diodes Inc. DMP21D0UT - 20V P-CHANNEL ENHANCEMENT MODE MOSFET This MOSFET has been designed to minimize the on-state resistance (R_DS(on)) and yet maintain superior switching performance, making it ideal for high efficiency power management applications. SparkFun Products: SparkFun MicroMod u-blox ZED-F9P Function Board; I_D: 590mA; PROD_ID: TRANS-16700; V_DSS: -20V
R1 R2 R13 R14 R20 R21 = SparkFun-Resistors:10KOHM: 10kΩ resistor A resistor is a passive two-terminal electrical component that implements electrical resistance as a circuit element. Resistors act to reduce current flow, and, at the same time, act to lower voltage levels within circuits. - Wikipedia; PROD_ID: RES-14241
R3 R4 = SparkFun-Resistors:5.1KOHM; PROD_ID: RES-14340
R5 = SparkFun-Resistors:3.3KOHM: 3.3kΩ resistor A resistor is a passive two-terminal electrical component that implements electrical resistance as a circuit element. Resistors act to reduce current flow, and, at the same time, act to lower voltage levels within circuits. - Wikipedia; PROD_ID: RES-15923; RES: 3.3k
R6 = SparkFun-Resistors:1KOHM: 1kΩ resistor A resistor is a passive two-terminal electrical component that implements electrical resistance as a circuit element. Resistors act to reduce current flow, and, at the same time, act to lower voltage levels within circuits. - Wikipedia; PROD_ID: RES-14342
R7 R8 = SparkFun-Resistors:4.7KOHM: 4.7kΩ resistor A resistor is a passive two-terminal electrical component that implements electrical resistance as a circuit element. Resistors act to reduce current flow, and, at the same time, act to lower voltage levels within circuits. - Wikipedia; PROD_ID: RES-15343
R9 R10 = SparkFun-Resistors:27OHM: 27Ω resistor A resistor is a passive two-terminal electrical component that implements electrical resistance as a circuit element. Resistors act to reduce current flow, and, at the same time, act to lower voltage levels within circuits. - Wikipedia; PROD_ID: RES-15238
R11 R12 = SparkFun-Resistors:2.2KOHM: 2.2kΩ resistor A resistor is a passive two-terminal electrical component that implements electrical resistance as a circuit element. Resistors act to reduce current flow, and, at the same time, act to lower voltage levels within circuits. - Wikipedia; PROD_ID: RES-14341
R15 = SparkFun-Resistors:1KOHM: 1kΩ resistor A resistor is a passive two-terminal electrical component that implements electrical resistance as a circuit element. Resistors act to reduce current flow, and, at the same time, act to lower voltage levels within circuits. - Wikipedia; PROD_ID: RES-14342; RESISTANCE: 1k
R16 = SparkFun-Resistors:100KOHM: 100kΩ resistor A resistor is a passive two-terminal electrical component that implements electrical resistance as a circuit element. Resistors act to reduce current flow, and, at the same time, act to lower voltage levels within circuits. - Wikipedia; PROD_ID: RES-13495
R17 = SparkFun-Resistors:10OHM: 10Ω resistor A resistor is a passive two-terminal electrical component that implements electrical resistance as a circuit element. Resistors act to reduce current flow, and, at the same time, act to lower voltage levels within circuits. - Wikipedia; PROD_ID: RES-12581
R18 = SparkFun-Resistors:220OHM: 220Ω resistor A resistor is a passive two-terminal electrical component that implements electrical resistance as a circuit element. Resistors act to reduce current flow, and, at the same time, act to lower voltage levels within circuits. - Wikipedia; PROD_ID: RES-15269
R19 = SparkFun-Resistors:470OHM: 470Ω resistor A resistor is a passive two-terminal electrical component that implements electrical resistance as a circuit element. Resistors act to reduce current flow, and, at the same time, act to lower voltage levels within circuits. - Wikipedia; PROD_ID: RES-15584
TP5-TP14 = SparkFun-Connectors:TEST-POINT: SparkFun Test Points Bare copper test points for troubleshooting or In-Circuit-Testing. These are used by our Production team for verifying production board runs using pogo-pins on test beds. SparkFun Products: SparkFun LSM9DS1 Breakout <https://www.sparkfun.com/products/13284> SparkFun PSOC <https://www.sparkfun.com/products/13714> SparkFun Load Cell Amplifier <https://www.sparkfun.com/products/13879>
U1 = SparkFun_MicroMod_GNSS_Function_Board_ZED-F9P:NLAST4501; PROD_ID: IC-16759
U2 = SparkFun-IC-Power:V_REG_AP2112: AP2112 - 600mA CMOS LDO Regulator w/ Enable The AP2112 is CMOS process low dropout linear regulator with enable function, the regulator delivers a guaranteed 600mA (min.) continuous load current. Features Output Voltage Accuracy: ±1.5% Output Current: 600mA (Min.) Foldback Short Current Protection: 50mA Enable Function to Turn ON/OFF VOUT Low Dropout Voltage (3.3V): 250mV (Typ.) @IOUT=600mA Excellent Load Regulation: 0.2%/A (Typ.) Excellent Line Regulation: 0.02%/V (Typ.) Low Quiescent Current: 55μA (Typ.) Low Standby Current: 0.01μA (Typ.) Low Output Noise: 50μVRMS PSRR: 100Hz -65dB, 1kHz -65dB OTSD Protection Stable with 1.0μF Flexible Cap: Ceramic, Tantalum and Aluminum Electrolytic Operation Temperature Range: -40°C to 85°C ESD: MM 400V, HBM 4000V; PROD_ID: VREG-12457
U3 = SparkFun-IC-Memory:EEPROM-I2C: I2C EEPROMs, 24LC256 and others 24LC256 Series 256 kb I2C 2 Wire (32 k x 8 Bit) 2.5 V Serial EEPROM SMD - SOIC-8 Datasheet SparkFun Products SparkFun UDB5 - PIC UAV Development Board <https://www.sparkfun.com/products/11703> (GPS-11703); PROD_ID: IC-14645
U4 U5 = SparkFun-IC-Logic:74LVC4066D_QUAD_BILATERAL_SWITCH: Nexperia Quad Bilateral Switch The 74LVC4066 is a high-speed Si-gate CMOS device. The 74LVC4066 provides four single pole, single-throw analog switch functions. Each switch has two input/output terminals (nY and nZ) and an active HIGH enable input (nE). When nE is LOW, the analog switch is turned off. Schmitt-trigger action at the enable inputs makes the circuit tolerant of slower input rise and fall times across the entire VCC range from 1.65 V to 5.5 V. Datasheet <https://assets.nexperia.com/documents/data-sheet/74LVC4066.pdf>; PROD_ID: IC-13944
U6 = SparkFun-IC-Amplifiers:OPA344: Single gate rail-to-rail output op-amp. Inputs extend 300mV past rails. Datasheet <http://www.ti.com/product/OPA344> SparkFun Products SparkFun Low Current Sensor <https://www.sparkfun.com/products/8883> (SEN-08883) SparkFun Electret Microphone Breakout <https://www.sparkfun.com/products/12758> (BOB-12758); PROD_ID: IC-08251
U7 = SparkFun_MicroMod_GNSS_Function_Board_ZED-F9P:74LVC541A: 74LVC541A IC OCTAL BUFFER, SCHMITT TRIGGER The 74LVC541A is an 8-bit buffer/line driver with 3-state outputs. The device features two output enables (OE1 and OE2). A HIGH on OEn causes the associated outputs to assume a high-impedance OFF-state . Inputs can be driven from either 3.3 V or 5 V devices. This feature allows the use of these devices as translators in mixed 3.3 V and 5 V environments. SparkFun Products: MicroMod Function u-blox ZED-F9P board; PROD_ID: IC-16698
U8 = SparkFun_MicroMod_GNSS_Function_Board_ZED-F9P:U-BLOX_ZED-F9P; PROD_ID: IC-14209
U9 = SparkFun_MicroMod_GNSS_Function_Board_ZED-F9P:FIN1017: OnSemi FIN1017 - 3.3V LVDS, 1-Bit, High-Speed Differential Driver This single driver is designed for high-speed interconnects utilizing Low Voltage Differential Signaling (LVDS) technology. The driver translates LVTTL signal levels to LVDS levels with a typical differential output swing of 350mV, which provides low EMI at ultra-low power dissipation even at high frequencies. This device is ideal for high-speed transfer of clock or data. SparkFun Products: SparkFun MicroMod u-blox ZED-F9P Function Board; PROD_ID: IC-16701
U10 U11 = SparkFun_MicroMod_GNSS_Function_Board_ZED-F9P:SN74AUP1T04: Texas Instruments SN74AUP1T04 - Single Inverter Gate The SN74AUP1T04 performs the Boolean function Y = !A! with designation for logic-level translation applications with output referenced to supply VCC. AUP technology is the industry's lowest-power logic technology designed for use in extending battery-life in operating. All input levels that accept 1.8-V LVCMOS signals, while operating from either a single 3.3-V or 2.5-V VCC supply. This product also maintains excellent signal integrity. The wide VCC range of 2.3 V to 3.6 V allows the possibility of switching output level to connect to external controllers or processors. Schmitt-trigger inputs (ΔVT = 210 mV between positive and negative input transitions) offer improved noise immunity during switching transitions, which is especially useful on analog mixed-mode designs. Schmitt-trigger inputs reject input noise, ensure integrity of output signals, and allow for slow input signal transition. SparkFun Products: SparkFun MicroMod u-blox ZED-F9P Function Board; PROD_ID: IC-16703
USBPWR WP = SparkFun-Jumpers:JUMPER-SMT_2_NO: Normally open jumper This jumper has two pads in close proximity to each other. Apply solder to close the connection. Round pads are easier to solder for beginners, but are a lot larger. SparkFun Product that uses the round pads: SparkFun EL Sequencer <https://www.sparkfun.com/products/12781>

## Net classes
0 default: width 0 mm, drill 0 mm, clearance 0.11 mm
3 RF_IN: width 0.35 mm, clearance 0.46 mm
4 3.3V: width 0.2 mm, clearance 0.2 mm
5 5V: width 0.2 mm, clearance 0.1 mm to class 4, clearance 0.2 mm
6 USB_DIFF: width 0.2 mm, clearance 0.2 mm
7 V_ZED: width 0.2 mm, clearance 0.2 mm
8 V_RF: width 0.2 mm
9 PPS_DIFF: width 0.2 mm, clearance 0.11 mm to class 0, clearance 0.2 mm
10 DIGITAL: width 0.09 mm, clearance 0.1 mm
11 ZED_DIG: width 0.1 mm, clearance 0.1 mm

## Board
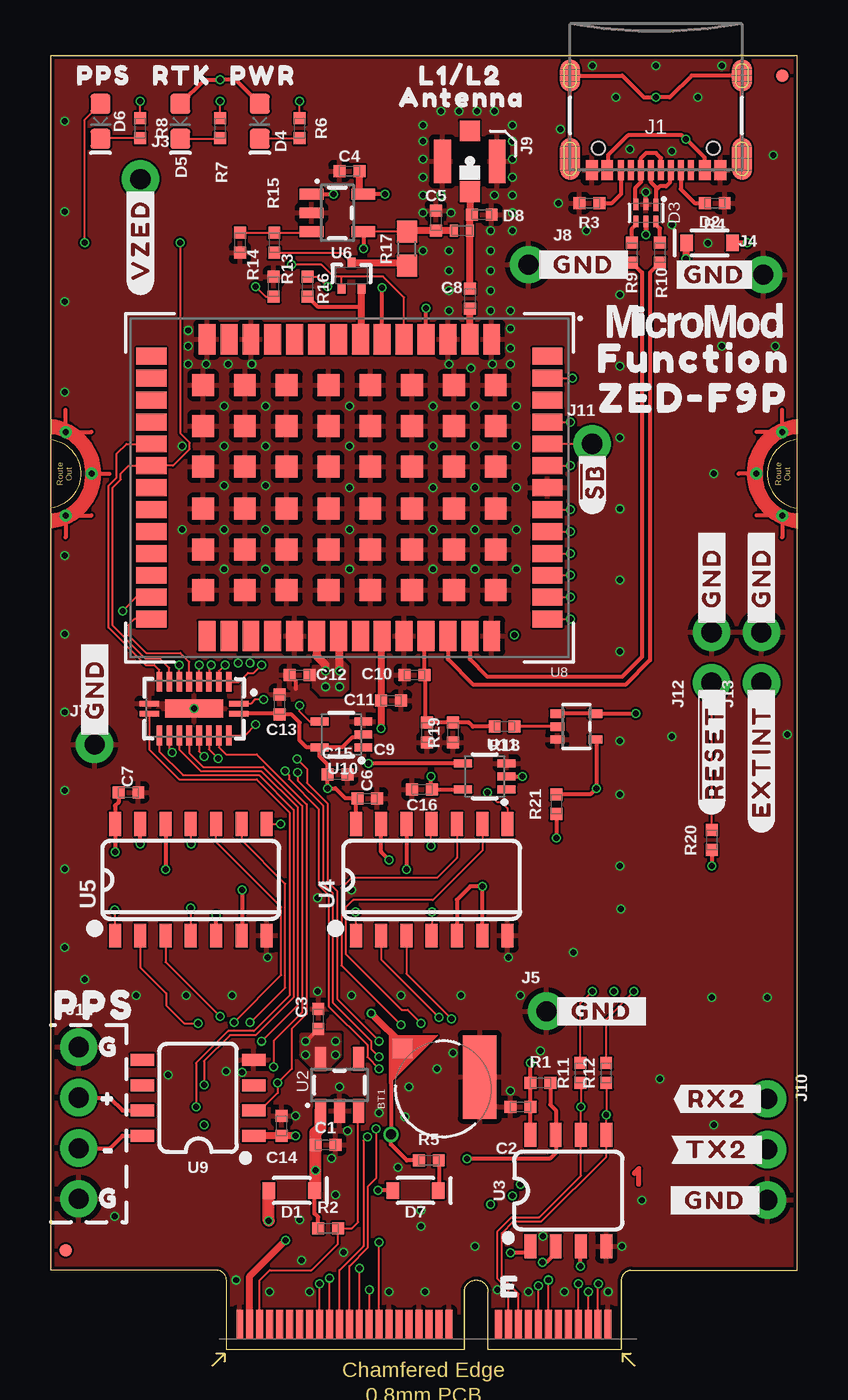
[diagram p1: board, top side]
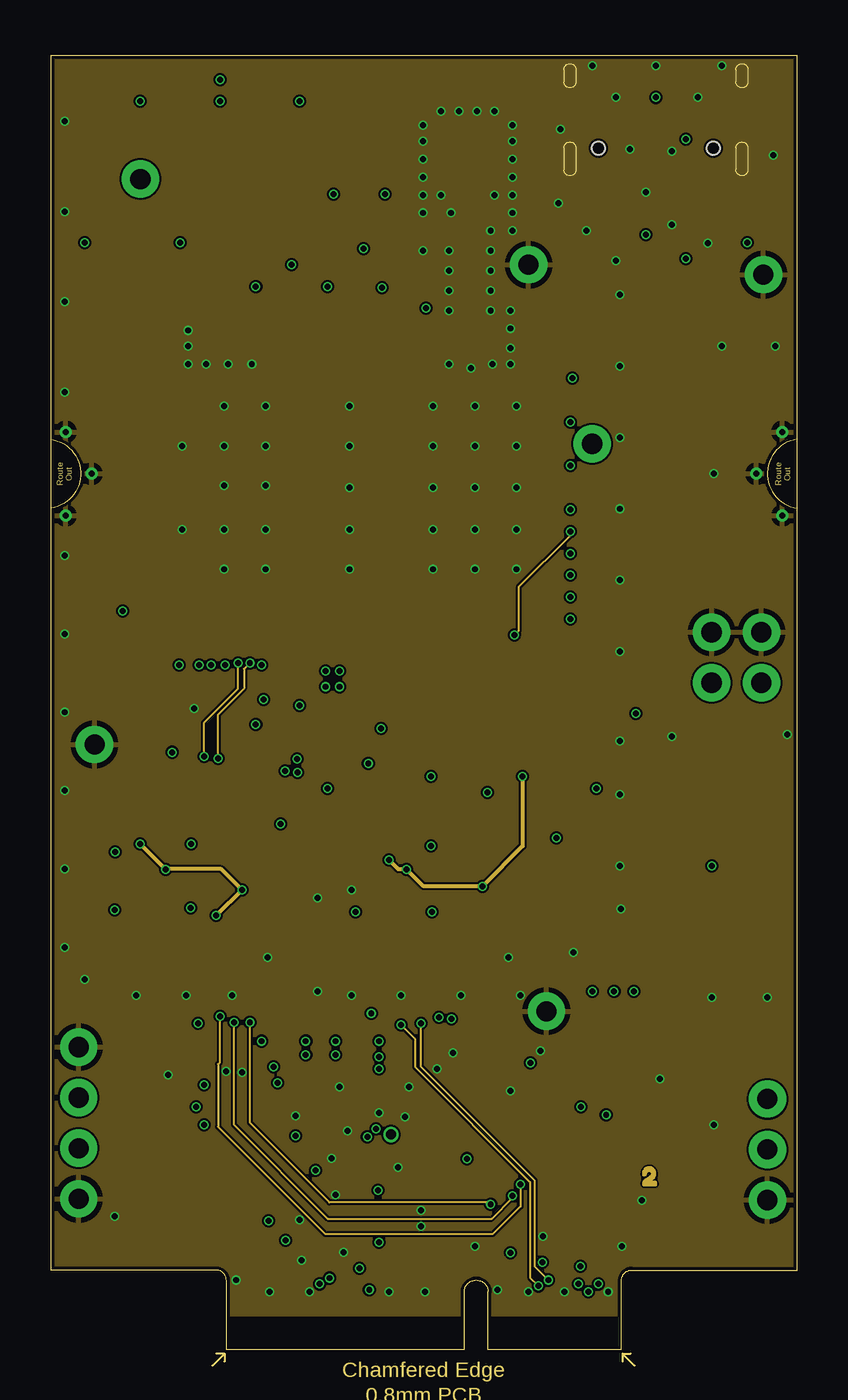
[diagram p2: board, inner layer Route2]
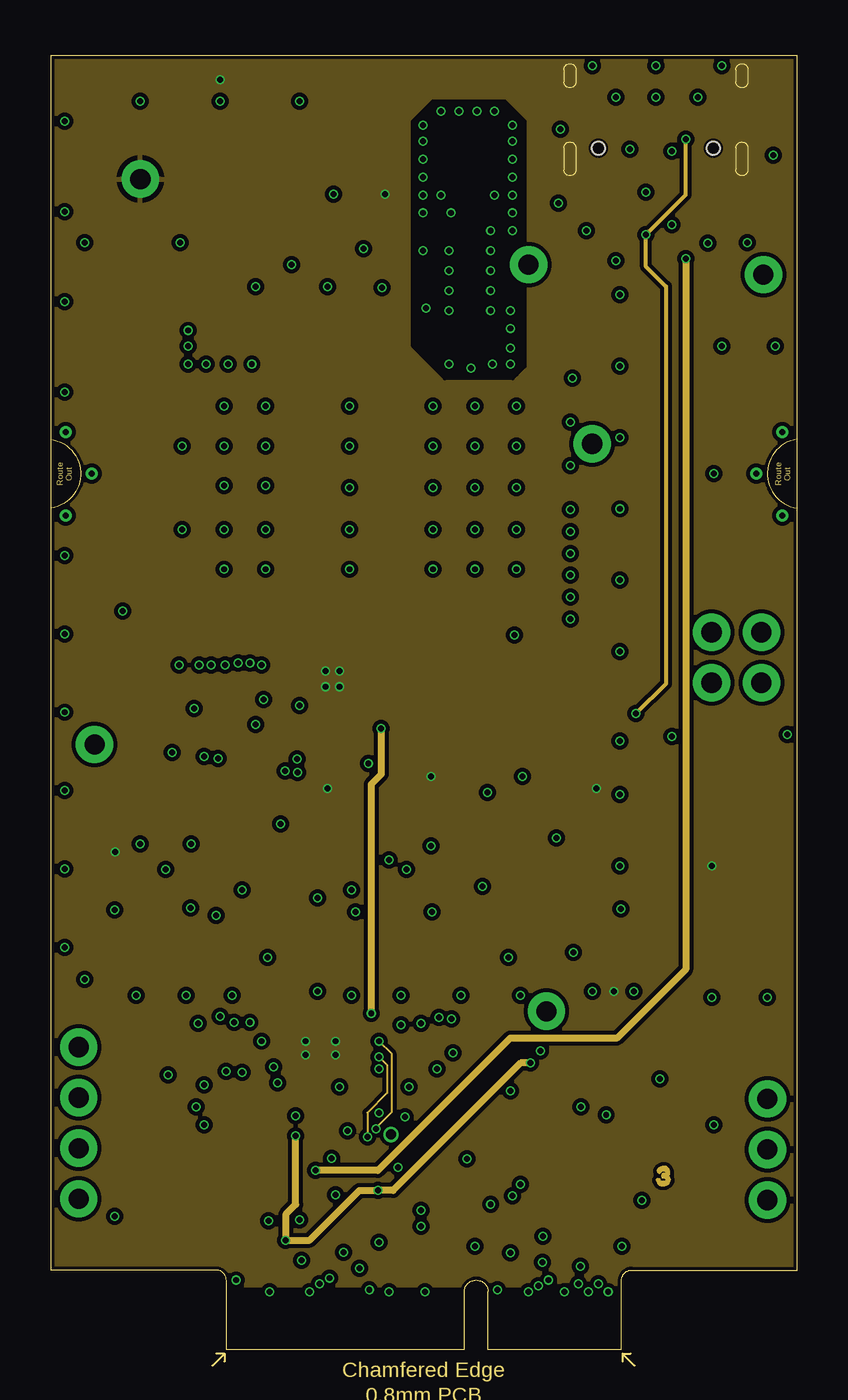
[diagram p3: board, inner layer Route15]
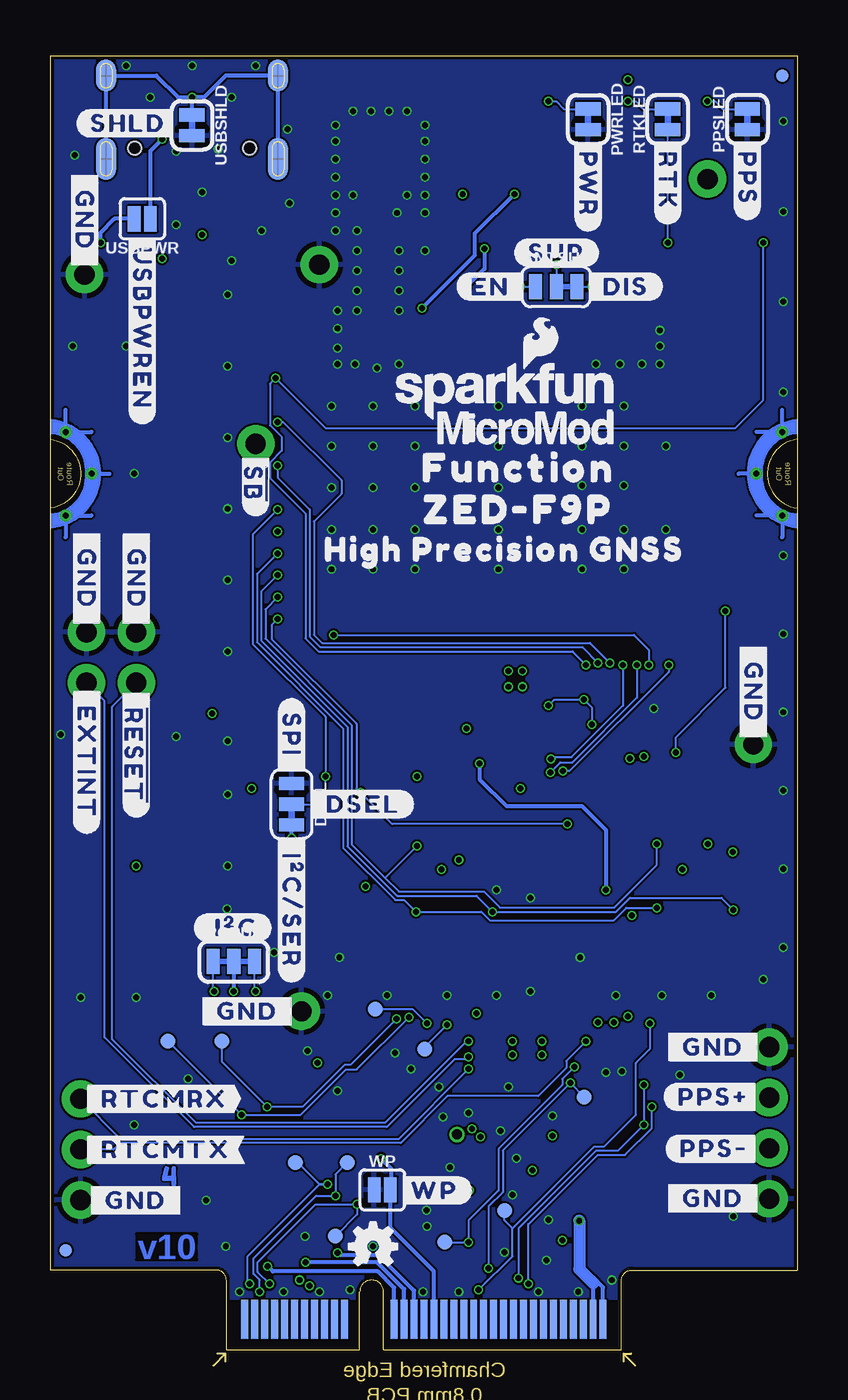
[diagram p4: board, bottom side, seen from below]

Size 37.5 x 65 mm. Coordinates in mm from the lower left corner, seen from the top.
Outline: 28.67,0 21.97,0 21.97,2.9 arc180 20.77,2.9 20.77,0 8.82,0 8.82,3.5 arc90 8.29,4 0,4 0,65 37.49,65 37.49,4 29.19,4 arc90 28.67,3.5 28.67,0
Copper layers (1+2*15+16): Top/Horz 0.035mm / dielectric 0.2mm / Route2 0.0175mm / dielectric 0.265mm / Route15 0.0175mm / dielectric 0.2mm / Bottom/Vert 0.035mm
Design rules "SparkFun-4-Layer-MicroMod-JLCPCB *": minimum track width 4mil, minimum drill 0.2mm, track to track 4mil, track to pad 4mil, pad to pad 4mil, via to via 4mil, smd to smd 4mil, copper to edge 6mil, drill to drill 6mil, minimum pad ring 3mil, minimum via ring 3mil, stop-mask expansion 2.5mil, vias tented up to drill 25mil, thermal gap 10mil

### Footprints (pad centres in the part's own frame; a part is rotated, then mirrored left to right if it is on the bottom)
SMT-JUMPER_3_1-NC_TRACE_SILK = smd 0.66 x 1.27: 1 -1.041,0; 2 0,0; 3 1.041,0
MS421R_IV03E = smd 1 x 1: + 2.022,2.032 | smd 4.2 x 1.7: - 0.6,-1.85
0402-TIGHT = smd 0.6 x 0.6: 1 -0.5,0; 2 0.5,0
SOD-323 = smd 0.63 x 0.83: A 1.15,0; C -1.15,0
SOT886 = smd 0.61 x 0.25: 1 -0.405,0.5 | smd 0.56 x 0.25: 2 -0.43,0; 3 -0.43,-0.5; 4 0.43,-0.5; 5 0.43,0; 6 0.43,0.5
LED-0603 = smd 1 x 1: A -0.877,0; C 0.877,0
FIDUCIAL-MICRO = smd 0.635 x 0.635: 1 0,0
SMT-JUMPER_3_2-NC_TRACE_SILK = smd 0.66 x 1.27: 1 -1.041,0; 2 0,0; 3 1.041,0
USB-C-16P-4LAYER-ISOLATED = smd 0.3 x 1: A5 -1.25,-0.34; A6 -0.25,-0.34; A7 0.25,-0.34; A8 1.25,-0.34; B5 1.75,-0.34; B6 0.75,-0.34; B7 -0.75,-0.34; B8 -1.75,-0.34 | smd 0.6 x 1: GND -3.225,-0.34; GND2 3.225,-0.34; VBUS1 -2.45,-0.34; VBUS2 2.45,-0.34 | smd 1 x 2.1: SHLD1 -4.32,-0.915; SHLD2 4.32,-0.915 | smd 1 x 2.1 bottom: SHLD3 -4.32,-0.915; SHLD4 4.32,-0.915 | smd 1 x 1.6: SHLD5 -4.32,-5.095; SHLD8 4.32,-5.095 | smd 1 x 1.6 bottom: SHLD6 -4.32,-5.095; SHLD7 4.32,-5.095 | hole 0.65: -2.89,-1.445; 2.89,-1.445
M.2-CARD-E-22_FUNCTION_STANDARD = smd 0.35 x 1.45: 1 9.25,1.275; 3 8.75,1.275; 5 8.25,1.275; 7 7.75,1.275; 9 7.25,1.275; 11 6.75,1.275; 13 6.25,1.275; 15 5.75,1.275; 17 5.25,1.275; 19 4.75,1.275; 21 4.25,1.275; 23 3.75,1.275; 33 1.25,1.275; 35 0.75,1.275; 37 0.25,1.275; 39 -0.25,1.275; 41 -0.75,1.275; 43 -1.25,1.275; 45 -1.75,1.275; 47 -2.25,1.275; 49 -2.75,1.275; 51 -3.25,1.275; 53 -3.75,1.275; 55 -4.25,1.275; 57 -4.75,1.275; 59 -5.25,1.275; 61 -5.75,1.275; 63 -6.25,1.275; 65 -6.75,1.275; 67 -7.25,1.275; 69 -7.75,1.275; 71 -8.25,1.275; 73 -8.75,1.275; 75 -9.25,1.275 | smd 0.35 x 1.95 bottom: 2 9,1.525; 4 8.5,1.525; 6 8,1.525; 8 7.5,1.525; 10 7,1.525; 12 6.5,1.525; 14 6,1.525; 16 5.5,1.525; 18 5,1.525; 20 4.5,1.525; 22 4,1.525; 32 1.5,1.525; 34 1,1.525; 36 0.5,1.525; 38 0,1.525; 40 -0.5,1.525; 42 -1,1.525; 44 -1.5,1.525; 46 -2,1.525; 48 -2.5,1.525; 50 -3,1.525; 52 -3.5,1.525; 54 -4,1.525; 56 -4.5,1.525; 58 -5,1.525; 60 -5.5,1.525; 62 -6,1.525; 64 -6.5,1.525; 66 -7,1.525; 68 -7.5,1.525; 70 -8,1.525; 72 -8.5,1.525; 74 -9,1.525 | drill 0.305 pad 0.61: GND1 -18,41.9; GND2 -16.7,44; GND3 -18,46.1; GND4 18,41.9; GND5 16.7,44; GND6 18,46.1
1X01_NO_SILK = drill 1.016 pad 1.88: 1 0,0
1X01_SMALL = drill 0.508: P$1 0,0
U.FL = smd 2.2 x 0.85: 1 0,1.375; 2 0,-1.375 | smd 1.05 x 1: FEED 1.525,0; NC -1.525,0
1X03_NO_SILK = drill 1.016 pad 1.88: 1 0,0; 2 2.54,0; 3 5.08,0
1X02_NO_SILK = drill 1.016 pad 1.88: 1 0,0; 2 2.54,0
1X04_NO_SILK = drill 1.016 pad 1.88: 1 0,0; 2 2.54,0; 3 5.08,0; 4 7.62,0
0402_MURATA = smd 0.4 x 0.6: 1 -0.4,0; 2 0.4,0
SMT-JUMPER_2_NC_TRACE_SILK = smd 0.66 x 1.27: 1 -0.521,0; 2 0.521,0
SOT523 = smd 0.4 x 0.51: 1 0,0.7; 2 0.5,-0.6; 3 -0.5,-0.6
0603 = smd 1.1 x 1: 1 -0.85,0; 2 0.85,0
PAD.03X.03 = smd 0.762 x 0.762: 1 0,0
SOT353 = smd 0.42 x 0.7: 1 -0.65,-0.95; 2 0,-0.95; 3 0.65,-0.95; 4 0.65,0.95; 5 -0.65,0.95
SOT23-5 = smd 0.55 x 1.2: 1 -0.95,-1.3; 2 0,-1.3; 3 0.95,-1.3; 4 0.95,1.3; 5 -0.95,1.3
SO08 = smd 0.6 x 1.2: 1 -1.905,-2.8; 2 -0.635,-2.8; 3 0.635,-2.8; 4 1.905,-2.8; 5 1.905,2.8; 6 0.635,2.8; 7 -0.635,2.8; 8 -1.905,2.8
SO14 = smd 0.6 x 1.2: 1 -3.175,-2.8; 2 -1.905,-2.8; 3 -0.635,-2.8; 4 0.635,-2.8; 5 1.905,-2.8; 6 3.175,-2.8; 7 4.445,-2.8; 8 4.445,2.8; 9 3.175,2.8; 10 1.905,2.8; 11 0.635,2.8; 12 -0.635,2.8; 13 -1.905,2.8; 14 -3.175,2.8
DHVQFN20 = smd 0.99 x 0.28: 1 -2.25,-0.25; 10 2.25,-0.25; 11 2.25,0.25; 20 -2.25,0.25 | smd 0.28 x 0.99: 2 -1.75,-1.35; 3 -1.25,-1.35; 4 -0.75,-1.35; 5 -0.25,-1.35; 6 0.25,-1.35; 7 0.75,-1.35; 8 1.25,-1.35; 9 1.75,-1.35; 12 1.75,1.35; 13 1.25,1.35; 14 0.75,1.35; 15 0.25,1.35; 16 -0.25,1.35; 17 -0.75,1.35; 18 -1.25,1.35; 19 -1.75,1.35 | smd 2.9 x 0.9: EPAD 0,0
ZED-F9P = smd 0.85 x 1.52: 1 -7.15,-7.45; 2 -6.05,-7.45; 3 -4.95,-7.45; 4 -3.85,-7.45; 5 -2.75,-7.45; 6 -1.65,-7.45; 7 -0.55,-7.45; 8 0.55,-7.45; 9 1.65,-7.45; 10 2.75,-7.45; 11 3.85,-7.45; 12 4.95,-7.45; 13 6.05,-7.45; 14 7.15,-7.45; 28 7.15,7.45; 29 6.05,7.45; 30 4.95,7.45; 31 3.85,7.45; 32 2.75,7.45; 33 1.65,7.45; 34 0.55,7.45; 35 -0.55,7.45; 36 -1.65,7.45; 37 -2.75,7.45; 38 -3.85,7.45; 39 -4.95,7.45; 40 -6.05,7.45; 41 -7.15,7.45 | smd 1.52 x 0.85: 15 9.95,-6.6; 16 9.95,-5.5; 17 9.95,-4.4; 18 9.95,-3.3; 19 9.95,-2.2; 20 9.95,-1.1; 21 9.95,0; 22 9.95,1.1; 23 9.95,2.2; 24 9.95,3.3; 25 9.95,4.4; 26 9.95,5.5; 27 9.95,6.6; 42 -9.95,6.6; 43 -9.95,5.5; 44 -9.95,4.4; 45 -9.95,3.3; 46 -9.95,2.2; 47 -9.95,1.1; 48 -9.95,0; 49 -9.95,-1.1; 50 -9.95,-2.2; 51 -9.95,-3.3; 52 -9.95,-4.4; 53 -9.95,-5.5; 54 -9.95,-6.6 | smd 1.1 x 1.1: 55 -1.05,-1.05; 56 -3.15,-1.05; 57 -5.25,-1.05; 58 -7.35,-1.05; 59 -1.05,-3.1; 60 -3.15,-3.1; 61 -5.25,-3.1; 62 -7.35,-3.1; 63 -1.05,-5.15; 64 -3.15,-5.15; 65 -5.25,-5.15; 66 -7.35,-5.15; 67 -1.05,5.15; 68 -3.15,5.15; 69 -5.25,5.15; 70 -7.35,5.15; 71 -1.05,3.1; 72 -3.15,3.1; 73 -5.25,3.1; 74 -7.35,3.1; 75 -1.05,1.05; 76 -3.15,1.05; 77 -5.25,1.05; 78 -7.35,1.05; 79 1.05,1.05; 80 3.15,1.05; 81 5.25,1.05; 82 7.35,1.05; 83 1.05,3.1; 84 3.15,3.1; 85 5.25,3.1; 86 7.35,3.1; 87 1.05,5.15; 88 3.15,5.15; 89 5.25,5.15; 90 7.35,5.15; 91 1.05,-5.15; 92 3.15,-5.15; 93 5.25,-5.15; 94 7.35,-5.15; 95 1.05,-3.1; 96 3.15,-3.1; 97 5.25,-3.1; 98 7.35,-3.1; 99 1.05,-1.05; 100 3.15,-1.05; 101 5.25,-1.05; 102 7.35,-1.05
SC-70-5_DCK = smd 0.4 x 0.9: 1 -0.65,-1.1; 2 0,-1.1; 3 0.65,-1.1; 4 0.65,1.1; 5 -0.65,1.1
SMT-JUMPER_2_NO_SILK = smd 0.635 x 1.27: 1 -0.406,0; 2 0.406,0

### Placement (x,y rotation side)
ANTSUP  12.1,53.4 0 bottom
BT1  19.7,13.1 90 top
C1  13.8,10.3 0 top
C2  23.6,12.2 180 top
C3  13.44,16.62 90 top
C4  15,59.2 180 top
C5  19.35,56.71 90 top
C6  15.9,27.7 0 top
C7  3.9,28 0 top
C8  21.05,52.8 270 top
C9  18.9,31 270 top
C10  18.27,33.9 180 top
C11  17.1,32.6 0 top
C12  12.5,33.9 180 top
C13  11.5,32.4 90 top
C14  11.6,11.24 90 top
C15  14.4,28.9 0 top
C16  18.65,28.15 180 top
D1  12.1,8 180 top
D2  33.1,55.6 0 top
D3  29.9,57.1 270 top
D4  10.5,61.7 270 top
D5  6.5,61.7 270 top
D6  2.5,61.7 270 top
D7  18.32,8 180 top
D8  21.65,57.01 0 top
DSEL  25.4,27.4 270 bottom
FD1  0.75,5 90 top
FD2  0.75,64 270 bottom
FD3  36.75,64 90 top
FD4  36.75,5 270 bottom
FRAME1  35.56,-8.89 0 top  (outside the outline)
I2CPUR  28.3,19.5 0 bottom
J1  30.4,58.9 180 top
J2  18.75,0 0 top
J3  4.5,58.8 270 top
J4  35.8,54 0 top
J5  24.9,17 0 top
J6  17.09,10.81 0 top
J7  2.2,30.4 0 top
J8  24,54.5 90 top
J9  21.05,59.69 270 top
J10  36,12.6 270 top
J11  27.2,45.5 0 top
J12  33.2,33.5 90 top
J13  35.7,33.5 90 top
J14  1.4,15.2 270 top
L1  20.65,56.21 0 top
LOGO1  -3.7,-10 0 top  (outside the outline)
LOGO2  45.72,60.96 0 top  (outside the outline)
LOGO3  21.3,5.2 0 bottom
LOGO4  SFE_LOGO_NAME_FLAME.1_INCH  [SFE_LOGO_NAME_FLAME_.1]  14.62,48.16 0 bottom
PPSLED  2.5,61.8 90 bottom
PWRLED  10.5,61.8 270 bottom
Q1  15.1,53.9 0 top
R1  24.6,13.4 0 top
R2  13.93,6.1 0 top
R3  27.05,57.6 0 top
R4  33.35,57.6 180 top
R5  18.99,9.51 0 top
R6  12.5,61.35 270 top
R7  8.5,61.35 270 top
R8  4.5,61.35 270 top
R9  29.2,55.1 270 top
R10  30.6,55.1 270 top
R11  26.6,13.9 90 top
R12  27.9,13.9 90 top
R13  12.9,53.4 270 top
R14  11.2,53.4 270 top
R15  11.23,55.6 90 top
R16  9.5,55.6 90 top
R17  17.9,55.3 90 top
R18  22.8,31.3 180 top
R19  20.2,31 90 top
R20  33.2,25.6 90 top
R21  25.4,27.4 90 top
RTKLED  6.5,61.8 90 bottom
TP5  28.9,15.5 0 bottom
TP6  31.6,15.5 0 bottom
TP7  18.7,15.1 0 bottom
TP8  21.2,17.1 0 bottom
TP9  10.7,12.7 0 bottom
TP10  25.2,9.4 0 bottom
TP11  14.7,7 0 bottom
TP12  22.6,9.4 0 bottom
TP13  23.2,5.7 0 bottom
TP14  17.7,5.4 0 bottom
U1  26.4,31.3 270 top
U2  14.5,13.3 0 top
U3  26,8 0 top
U4  18.5,23.6 0 top
U5  6.4,23.6 0 top
U6  14.4,57.1 270 top
U7  7.2,32.2 180 top
U8  15,43.3 180 top
U9  7.4,12.65 90 top
U10  14.6,30.9 90 top
U11  21.8,28.8 90 top
U$1  [40]  32.6,8.7 0 bottom
U$2  [#_RTCMTX#0]  36,10.05 0 bottom
U$3  [#TX2_#0]  31.2,10.05 0 top
U$5  [#_GND_#0]  30.8,7.5 0 top
U$6  [#_GND_#0]  35.8,7.5 0 bottom
U$7  [#_GND_#0]  25.1,17 0 top
U$9  [#_GND_#0]  30.2,17 0 bottom
U$10  [#_GND_#0]  6.8,7.6 0 bottom
U$11  [#_GND_#0]  6.8,15.2 0 bottom
U$12  [#_RTCMRX#0]  36,12.6 0 bottom
U$13  [#RX2_#0]  31.3,12.6 0 top
U$14  [##RESET_##0]  33.2,26.9 90 top
U$15  [#_#RESET##0]  33.2,33.3 270 bottom
U$16  [#_EXTINT#0]  35.7,33.4 270 bottom
U$17  [#EXTINT_#0]  35.7,26 90 top
U$18  [#_GND_#0]  33.2,41.3 270 bottom
U$19  [#_GND_#0]  35.7,41.3 270 bottom
U$21  [#_GND_#0]  33.2,36.2 90 top
U$22  [#_GND_#0]  35.7,36.2 90 top
U$23  [#_I�C#SER#0]  25.4,26 270 bottom
U$24  [#SPI_#0]  25.4,32.7 270 bottom
U$25  [#_GND_#0]  35.8,59.3 270 bottom
U$26  [FUNCTION0]  32.3,49.8 0 top
U$27  [FUNCTION0]  14,44.3 0 bottom
U$28  [#_I�C#0]  30.3,21.2 0 bottom
U$29  [#_DSEL#0]  24.7,27.4 0 bottom
U$30  [#SUP#0]  14.2,55.1 0 bottom
U$31  [#RTK#0]  6.5,60.9 270 bottom
U$32  [#PWR#0]  10.5,60.9 270 bottom
U$33  [#_GND_#0]  24.2,54.5 0 top
U$34  [10]  28.5,8.7 0 top
U$35  [211]  29,8.7 0 top
U$36  [3212]  29.7,8.7 0 top
U$37  [MICROMOD_LOGO_.35]  13.7,46.3 0 bottom
U$38  [#_GND_#0]  2.2,30.6 90 top
U$39  [#_GND_#0]  2.2,35.6 270 bottom
U$40  [PPS3]  -0.9,17.3 0 top
U$44  [#PPS##2252]  6.7,12.7 0 bottom
U$45  [#PPS##2253]  6.6,10.1 0 bottom
U$46  [G2]  1.7,15.2 0 top
U$47  [G2]  1.7,7.6 0 top
U$48  [#3]  1.8,12.6 0 top
U$49  [#4]  1.9,10 0 top
U$50  [#PPS#2254]  2.5,60.9 270 bottom
U$51  [PPS0]  0.6,64 0 top
U$52  [RTK0]  4.4,64 0 top
U$54  [#WP#0]  20.1,8 0 bottom
U$62  [#USBPWREN#10]  32.9,56.1 270 bottom
U$63  [MICROMOD_LOGO_.35]  32.3,51.65 0 top
U$64  [#SHLD#12]  36.2,61.6 0 bottom
U$68  [#VZED#0]  4.5,53 90 top
U$72  [PWR0]  8.3,64 0 top
U$73  [#_DIS#0]  10.8,53.4 0 bottom
U$74  [#EN_#0]  17.1,53.4 0 bottom
U$76  [##SB##9]  27.2,45.1 270 bottom
U$80  [##SB##0]  27.2,42 90 top
U$82  [#GND#0]  31.1,54 0 top
U$85  [L1#L20]  17.8,64 0 top
U$87  [ANTENNA0]  16.8,62.9 0 top
U$104  [SFE_LOGO_FLAME_STOP_.1]  27.4,39.8 0 top
U$106  [HIGH_PRECISION_GNSS26]  14.7,40.2 0 bottom
U$112  [ZED#F9P0]  32.3,47.8 0 top
U$114  [ZED#F9P0]  14,42.2 0 bottom
USBPWR  32.9,56.8 180 bottom
USBSHLD  30.4,61.5 270 bottom
WP  20.84,8.03 0 bottom

### Tracks (layer width: path | path; a pad name or v marks a point on that pad's centre or on a via)
3.3V  (via drill 0.3)
  Top/Horz 0.2: D7.A v16.45,8 | U3.8 C2.1 R1.1 v24.1,14.4
  Top/Horz 0.35: v12.3,10.74 C14.1 U9.1 | J2.73 10,3.7 v11.8,5.5
  Route15 0.35: v12.3,10.74 12.3,7.3 11.8,6.8 v11.8,5.5 13,5.5 15.5,8 v16.45,8 17.2,8 23.6,14.4 v24.1,14.4
5V  (via drill 0.3)
  Top/Horz 0.2: R2.1 13.43,6.67 13.25,6.85 D1.C
  Top/Horz 0.35: D2.C 31.9,55.55 v31.9,54.8
  Top/Horz 0.6: U2.1 13.55,11.15 13.3,10.9 C1.1 v13.3,9 13.3,8.05 D1.C
  Route15 0.35: v31.9,54.8 31.9,19.1 28.44,15.64 23.08,15.64 16.44,9 v13.3,9
!RESET!  (via drill 0.3)
  Top/Horz 0.11: v12.37,29.67 12.87,29.17 12.87,28.47 13.9,27.44 13.9,23.53 14.39,23.04 14.39,17.61 v16.5,15.5 | v16.33,11.1 16.33,8.6 15.93,8.2 15.93,5.13 15,4.2 J2.53 | v8.75,34.4 8.45,34.1 U7.3 | R20.2 J12.1
  Route15 0.11: v16.5,15.5 17.11,14.89 17.11,11.91 16.33,11.13 v16.33,11.1
  Bottom/Vert 0.11: v8.75,34.4 8.75,32.35 11.33,29.77 12.27,29.77 v12.37,29.67 | v16.5,15.5 16.6,15.5 20.7,11.4 30.2,11.4 34.4,15.6 34.4,32.3 J12.1
!ZED_DSEL!  (via drill 0.3)
  Top/Horz 0.2: v4.5,25.41 U5.13 | U11.4 v15.95,29.45 | U5.12 v5.76,24.14 | U5.5 v8.3,21.8 | v9.6,23.1 9.6,20.82 U5.6
  Route2 0.2: v4.5,25.41 v5.76,24.14 v5.77,24.14 8.56,24.14 v9.6,23.1 v8.3,21.8
  Bottom/Vert 0.2: v15.95,29.45 15.95,28.65 14.6,27.3 10.8,27.3 9.6,26.1 v9.6,23.1
A0  (via drill 0.3)
  Top/Horz 0.2: v23.1,4.87 23.93,4.87 23.95,4.9 23.95,5.06 U3.1
  Bottom/Vert 0.2: v23.1,4.87 22.99,4.75 21.03,4.75 19.25,2.97 J2.36
A1  (via drill 0.3)
  Top/Horz 0.2: v24.7,4.4 24.89,4.4 25.36,4.87 U3.2
  Bottom/Vert 0.2: v24.7,4.4 21.1,4.4 19.75,3.04 J2.34
A2  (via drill 0.3)
  Top/Horz 0.2: v26.6,4.2 26.6,5.17 U3.3
  Bottom/Vert 0.2: v26.6,4.2 26.33,3.93 21.06,3.93 20.25,3.12 J2.32
EWP  (via drill 0.3)
  Top/Horz 0.2: v20.9,9.6 25.07,9.6 25.36,9.9 U3.7 25.36,12.04 25.1,12.3 R1.2
  Bottom/Vert 0.2: v20.9,9.6 20.4,9.1 20.4,8.06 WP.2 20.43,6.13 18.25,3.95 J2.40
EXTINT  (via drill 0.3)
  Top/Horz 0.11: v12.4,29 12.4,28.6 13.67,27.33 13.67,23.43 14.18,22.92 14.18,17.43 16.11,15.49 16.11,15.09 v16.5,14.7 | v15.9,10.7 15.7,10.5 15.7,5.2 14.5,4 J2.55 | v8.05,34.4 7.95,34.3 U7.4
  Route15 0.11: v16.5,14.7 16.9,14.3 16.9,12.9 15.9,11.9 v15.9,10.7
  Bottom/Vert 0.11: v8.05,34.4 8.05,32.75 11.3,29.5 11.9,29.5 v12.4,29 | v16.5,14.7 16.6,14.6 17.2,14.6 20.61,11.19 30.3,11.19 34.79,15.69 34.79,32.59 J13.1
GEO_STAT  (via drill 0.3)
  Top/Horz 0.11: U7.11 4.95,30.14 6.45,28.64 10.35,28.64 11.99,27 11.99,17.8 10.21,16.01 8.91,16.01 7.3,14.4 v7.3,12.2 | J2.59 v13.5,3.3
  Bottom/Vert 0.11: v13.5,3.3 13.5,6.3 10.01,9.79 8.64,9.79 7.3,11.13 v7.3,12.2
GND  (via drill 0.3)
  Top/Horz 0.2: D3.2 v29.9,58.15 | C12.2 12.3,33.6 12.3,33.2
  other vias: 33.2,17.7 27.2,64.5 30.4,64.5 33.7,64.5 0.7,61.7 0.7,48.1 0.7,52.63 0.7,57.17 0.7,39.9 0.7,35.96 0.7,32.02 0.7,28.08 9.1,17.8 6.8,17.8 4.3,17.8 0.7,24.14 0.7,20.2 1.7,18.6 28.6,49.41 28.6,45.82 28.6,42.24 28.6,38.65 28.6,35.06 28.6,30.57 28.6,27.89 28.6,24.3 26.27,19.97 23.6,17.8 20.6,17.8 17.6,17.8 25.6,61.3 25.5,57.6 26.9,56.2 28.4,54.7 28.6,53 28.63,22.13 31.2,60.2 29.1,60.3 31.2,56.5 33,55.59 23.1,13 28,2.9 25.8,2.9 24,2.9 22.45,3 18.8,2.9 17,2.9 12.6,4.5 11,2.9 13,2.9 9.3,3.5 5.9,13.8 12.3,11.74 14.9,11 14.5,13.2 9.61,13.92 3.2,6.7 14.3,7.79 16.5,11.9 17.8,11.7 18,13.2 19.4,14.1 20.2,14.9 30.6,13.6 29.7,7.5 33.3,11.3 36,17.7 31.2,30.8 37,30.9 33.3,44 33.7,50.4 36.4,50.4 36.3,60 24.6,15 13.4,18 21.3,5.2 24.73,5.7 12.5,6.52 14.7,4.9 32.5,62.9 28.4,62.9 14.1,9.62 17.45,9.15 28.7,5.2 8.81,13.97 18.61,7.01 18.59,6.2 7.2,32.2 22.1,55.2 18.7,57.1 20.1,57.1 20,55.2 20,54.2 20,53.2 20,52.2 22.1,54.2 22.1,53.2 22.1,52.2 23.1,52.2 23.1,51.3 23.1,50.3 23.1,49.5 22.2,49.5 20,49.5 21.1,49.3 22.1,56.2 23.2,56.2 23.2,57.1 22.3,58 23.2,58 23.2,58.9 23.2,59.8 23.2,60.7 23.2,61.5 22.3,62.2 21.4,62.2 20.5,62.2 19.6,62.2 18.7,61.5 18.7,60.7 18.7,59.8 18.7,58.9 18.7,58 19.6,58 6.9,51.2 6.9,50.4 6.9,49.5 7.8,49.5 8.9,49.5 10.1,49.5 6.6,45.4 6.6,41.2 8.7,47.4 10.8,47.4 8.7,45.4 10.8,45.4 8.7,43.4 10.8,43.4 8.7,41.2 10.8,41.2 8.7,39.2 10.8,39.2 15,39.2 15,41.2 15,43.3 15,45.4 15,47.4 19.2,47.4 21.3,47.4 23.4,47.4 23.4,45.4 21.3,45.4 19.2,45.4 19.2,43.3 21.3,43.3 23.4,43.3 19.2,41.2 21.3,41.2 23.4,41.2 19.2,39.2 21.3,39.2 23.4,39.2 18.7,55.2 15.1,23.1 15.1,17.8 13.4,22.7 10.9,19.7 23,19.7
  pour Top/Horz (rank 3): -0.5,65.2 -0.5,1.9 38,1.9 38,65.2
  pour Route2 (rank 3): -0.5,65.2 -0.5,1.8 38,1.8 38,65.2
  pour Bottom/Vert (rank 3): -0.4,65.2 -0.4,2.6 38,2.6 38,65.2
  cutout Top/Horz: 20.3,60.5 21.8,60.5 21.8,58.9 20.3,58.9
IO_!OE!  (via drill 0.3)
  Top/Horz 0.11: U7.1 10.05,32.45 10.25,32.65 v10.7,32.65 | U10.4 13,31.55 12.5,32.05 v12.5,32.35 | U7.19 9.75,30.85 v10.3,31.4
  Bottom/Vert 0.11: v12.5,32.35 12.2,32.65 v10.7,32.65 10.3,32.25 v10.3,31.4
MM_!CS!  (via drill 0.3)
  Top/Horz 0.11: J2.49 v16,3 | U5.2 4.5,19.2 5.8,17.9 5.8,17.3 6.7,16.4 v7.4,16.4
  Bottom/Vert 0.11: v16,3 14.3,4.7 14.3,6.1 | v7.4,16.4 7.4,15.1 8.1,14.4 8.1,11.8 9.69,10.21 10.19,10.21 14.3,6.1 | TP11.1 14.7,6.5 14.3,6.1
MM_PICO  (via drill 0.3)
  Top/Horz 0.11: U5.10 8.3,25.5 11.57,22.23 11.57,18.82 v9.2,16.44 | J2.5 v27,2.9
  Route2 0.11: v23.2,7.73 23.2,7.63 22.16,6.59 13.91,6.59 9.2,11.3 v9.2,16.44
  Bottom/Vert 0.11: v27,2.9 27,3.5 27.31,3.81 27.31,4.59 24.17,7.73 v23.2,7.73 23.2,8.8 TP12.1
MM_POCI  (via drill 0.3)
  Top/Horz 0.11: v10,16.44 10.04,16.44 11.78,18.18 11.78,23.4 9.57,25.61 U5.9 | J2.7 v26.5,3.3
  Route2 0.11: v22.1,7.3 22,7.4 14,7.4 10,11.4 v10,16.44
  Bottom/Vert 0.11: v26.5,3.3 27.1,3.9 27.1,4.4 24.2,7.3 v22.1,7.3 22.1,6.8 TP13.1
MM_RX  (via drill 0.3)
  Top/Horz 0.11: v17.6,16.31 v17.59,16.31 14.6,19.3 14.6,23.2 15.1,23.7 19.4,23.7 20.41,24.7 U4.10 | J2.15 v24.5,3.2
  Route2 0.11: v17.6,16.31 18.3,15.61 18.3,14.2 24.08,8.42 24.08,3.62 v24.5,3.2
  Bottom/Vert 0.11: TP7.1 18.7,15.21 v17.6,16.31
MM_SCK  (via drill 0.3)
  Top/Horz 0.11: J2.3 v27.5,3.3 | U5.3 5.76,19.48 v8.5,16.74
  Route2 0.11: v23.6,8.3 23.6,7.2 22.2,5.8 13.8,5.8 8.4,11.2 8.4,14.34 8.5,14.44 v8.5,16.74
  Bottom/Vert 0.11: v27.5,3.3 27.6,3.4 27.6,4.7 24,8.3 v23.6,8.3 24,8.3 25.1,9.4 TP10.1
MM_SCL  (via drill 0.3)
  Top/Horz 0.11: J2.21 23,3 22.43,3.57 22.43,5.94 23.15,6.65 24.54,6.65 26.64,8.74 U3.6 v26.64,12.2 26.64,13.37 R11.1 | U4.3 17.86,18.88 v20.12,16.62
  Bottom/Vert 0.11: v20.12,16.62 22.42,14.32 22.72,14.32 24.84,12.2 v26.64,12.2 28.9,14.46 TP5.1
MM_SDA  (via drill 0.3)
  Top/Horz 0.11: J2.19 23.5,2.8 23.5,2.81 22.65,3.65 22.65,5.85 23.24,6.44 24.64,6.44 27.91,9.7 U3.5 v27.9,11.8 R12.1 | U4.2 16.59,19.61 v19.5,16.7
  Bottom/Vert 0.11: v19.5,16.7 22.13,14.07 22.67,14.07 24.94,11.8 v27.9,11.8 TP6.1
MM_TX  (via drill 0.3)
  Top/Horz 0.11: v18.6,16.4 17.92,17.08 17.62,17.08 14.81,19.89 14.81,22.21 15.19,22.59 19.19,22.59 21.68,25.07 U4.9 | J2.13 v25,3.5
  Route2 0.11: v18.6,16.4 18.6,14.2 24.3,8.5 24.3,4.2 v25,3.5
  Bottom/Vert 0.11: v18.6,16.4 19.3,17.1 TP8.1
N$1  (via drill 0.3)
  Top/Horz 0.11: R13.1 13.4,53.9 v13.9,53.4
  Bottom/Vert 0.11: v13.9,53.4 ANTSUP.1
N$2  (via drill 0.3)
  Top/Horz 0.11: v10.3,53.4 10.8,52.9 R14.2
  Bottom/Vert 0.11: ANTSUP.3 v10.3,53.4
N$3
  Top/Horz 0.2: J1.B5 28.65,58.05 28.2,57.6 R3.2
N$4
  Top/Horz 0.2: J1.A5 31.65,58.3 32.35,57.6 R4.2
N$5  (via drill 0.3)
  Top/Horz 0.2: R21.1 v25.4,25.7
  Bottom/Vert 0.2: v25.4,25.7 DSEL.3
N$6  (via drill 0.3)
  Top/Horz 0.11: R11.2 26.6,17.4 v27.2,18
  Bottom/Vert 0.11: v27.2,18 27.26,18.06 I2CPUR.3
N$7
  Top/Horz 0.35: C8.1 L1.2 21.05,56.91 D8.1 21.05,57.11 J9.FEED
N$8  (via drill 0.3)
  Top/Horz 0.11: R7.1 v8.5,62.7
  Bottom/Vert 0.11: v8.5,62.7 8.1,62.7 7.72,62.32 RTKLED.2
N$9  (via drill 0.3)
  Top/Horz 0.11: R12.2 27.9,16.6 v29.3,18
  Bottom/Vert 0.11: v29.3,18 29.34,18.04 I2CPUR.1
N$13
  Top/Horz 0.11: R15.1 14.6,55.1 Q1.1
  Top/Horz 0.35: Q1.1 17.75,54.6 R17.1
N$14
  Top/Horz 0.2: R18.2 21.2,31.3 21,31.5 R19.2 C9.1 18.8,31.6 18.8,33.87 C10.1 18.77,35.77 U8.38
N$16  (via drill 0.3)
  Top/Horz 0.2: v35,55.6 D2.A
  Bottom/Vert 0.2: v35,55.6 35,56.1 34.3,56.8 USBPWR.2
N$26  (via drill 0.3)
  Top/Horz 0.11: R6.1 v12.5,62.7
  Bottom/Vert 0.11: v12.5,62.7 12.1,62.7 11.72,62.32 PWRLED.1
N$27  (via drill 0.3)
  Top/Horz 0.11: R8.1 v4.5,62.7
  Bottom/Vert 0.11: v4.5,62.7 4.1,62.7 3.72,62.32 PPSLED.2
N$28
  Top/Horz 0.11: R8.2 2.53,60.85 D6.C
N$29
  Top/Horz 0.11: D5.C 8.47,60.82 R7.2
N$30
  Top/Horz 0.11: R6.2 12.47,60.82 D4.C
N$32
  Top/Horz 0.2: R5.2 19.49,8.02 D7.C
N$48
  Top/Horz 0.11: R16.2 R15.2 13.05,56.1 U6.3
PPS  (via drill 0.3)
  Top/Horz 0.11: U7.18 8.45,30.25 8.8,29.9 10.35,29.9 12.85,27.4 12.85,23.65 12.85,16.86 12.1,16.11 12.1,14.1 v11.4,13.4 11.4,12.9 10.52,12.02 U9.2 | J2.51 v15.5,4.1
  Bottom/Vert 0.11: v15.5,4.1 15.5,7.2 14.79,7.91 14.79,10.01 v11.4,13.4 TP9.1
PPS_DIFF_N
  Top/Horz 0.2: J14.3 2.98,10.12 3.6,10.74 U9.8
PPS_DIFF_P
  Top/Horz 0.2: J14.2 2.96,12.66 3.6,12.02 U9.7
PWR_EN
  Top/Horz 0.11: J2.71 10.5,3.5 11,4 13.1,4 14.43,5.33 R2.2 15.13,6.1 15.44,6.41 U2.3
RF_IN
  Top/Horz 0.35: U8.2 C8.2
RTK_STAT  (via drill 0.3)
  Top/Horz 0.11: U7.12 5.45,30.05 6.64,28.86 10.46,28.86 12.21,27.11 12.21,17.71 10.3,15.8 9,15.8 7.7,14.5 v7.7,13.3 | J2.57 v14,3.6
  Bottom/Vert 0.11: v7.7,13.3 v7.7,11.3 9,10 10.1,10 14,6.1 v14,3.6
RX2/RTCM  (via drill 0.3)
  Top/Horz 0.11: U7.7 v6.45,34.4 | v11.76,29.06 11.96,28.86 11.96,28.66 13.46,27.16 13.46,23.34 13.96,22.84 13.96,17.24 15.9,15.3 15.9,14.7 v16.5,14.1
  Bottom/Vert 0.11: v6.45,34.4 6.45,34.05 11.44,29.06 v11.76,29.06 | J10.1 34,10.6 20,10.6 v16.5,14.1
SHLD  (via drill 0.3)
  Top/Horz 0.2: J1.SHLD4 J1.SHLD8 28.7,63.99 29.8,62.9 v30.4,62.9 31.1,62.9 32.2,63.99 J1.SHLD6 J1.SHLD1
  Bottom/Vert 0.2: J1.SHLD1 J1.SHLD6 32.2,63.99 31.1,62.9 v30.4,62.9 | J1.SHLD4 J1.SHLD8 28.7,63.99 29.8,62.9 v30.4,62.9 | USBSHLD.1 v30.4,62.9
TX2/RTCM  (via drill 0.3)
  Top/Horz 0.11: U7.14 6.45,30.15 7.53,29.07 10.57,29.07 12.42,27.23 12.42,17.32 v10.6,15.5
  Bottom/Vert 0.11: J10.2 34.34,10.06 34.01,10.39 19.91,10.39 17.55,12.75 13,12.75 11.6,14.15 11.6,14.5 v10.6,15.5
TX_READY  (via drill 0.3)
  Top/Horz 0.11: U7.15 6.95,29.97 7.64,29.28 10.67,29.28 12.63,27.32 12.63,16.93 11.2,15.51 v11.2,14.2 | J2.47 v16.5,5.4
  Bottom/Vert 0.11: v11.2,14.2 11.8,13.6 11.8,13.3 15,10.1 15,8 16.5,6.5 v16.5,5.4 TP14.1
USB_N
  Top/Horz 0.2: D3.6 30.4,56.52 30.6,56.31 R10.1
USB_P
  Top/Horz 0.2: D3.4 29.4,56.52 29.2,56.31 R9.1
USBC_N
  Top/Horz 0.2: J1.A7 30.15,58.64 30.43,58.37 30.43,58.27 | 30.43,58.27 30.43,57.53 D3.1 | J1.B7 31.15,59.09 31.1,59.04 31.1,58.62 30.92,58.44 30.6,58.44 30.43,58.27
USBC_P
  Top/Horz 0.2: D3.3 29.37,57.56 29.37,58.37 29.65,58.64 J1.B6 29.65,59.85 29.9,60.1 30.4,60.1 30.65,59.85 J1.A6
V_BATT  (via drill 0.3)
  Top/Horz 0.2: 17.77,15.23 BT1.+ 17.09,14.54 J6.P$1 17.09,10.31 17.89,9.51 R5.1 | U8.36 16.6,35.8
  Top/Horz 0.35: v16.6,31.2 C11.1 16.6,35.8 | v16.1,16.9 17.77,15.23
  Route15 0.35: v16.6,31.2 16.6,28.9 16.1,28.4 v16.1,16.9
V_RF
  Top/Horz 0.2: R13.2 13.4,52.4 15.6,52.4
  Top/Horz 0.35: U8.7 15.6,50.8 15.6,52.4 Q1.2
V_USB  (via drill 0.3)
  Top/Horz 0.2: J1.VBUS2 28,59.29 28,60 29,61 31.7,61 v31.9,60.8 31.93,60.8 32.85,59.88 J1.VBUS1 | U1.1 U1.5 v29.4,31.95
  Top/Horz 0.25: D3.5 v29.9,56.01
  Route15 0.2: v31.9,60.8 31.9,58.01 v29.9,56.01 29.9,54.4 30.9,53.4 30.9,33.45 v29.4,31.95
  Bottom/Vert 0.2: v31.9,60.8 32.49,60.21 USBPWR.1
V_ZED  (via drill 0.3)
  Top/Horz 0.2: U7.20 11.45,31.95 C13.1 12.1,31.9 12.5,31.5 12.5,30.6 12.85,30.25 U10.5 | C7.1 3.4,27.5 3.23,27.32 U5.14 v3.23,25 | U4.14 15.32,27.62 | v16.8,58.05 U6.5 | v19.1,28.8 19.1,28.2 C16.1 U11.5 | C6.1 14.8,27.7 14.3,28.2 v13.9,28.2 C15.1 13.9,29.4 13.5,29.8 U10.5 | U1.4 27.4,30.6 v27.4,28.2 27.1,27.9 R21.2 | R20.1 v33.2,24.3 | D5.A 7.72,63.8 v8.5,63.8 9.28,63.8 D4.A | U10.2 15.55,30.75 15.13,30.75 14.63,30.25 U10.5 | C3.1 v12.82,15.5 v12.81,15.5
  Top/Horz 0.35: U6.5 15.5,58.25 C4.1
  Top/Horz 0.4: 15.32,27.62 C6.1 | v14.5,34.1 14.5,35.8 U8.34 | v13.8,34.1 13.8,34.4 13.35,34.85 U8.33
  Bottom/Vert 0.2: I2CPUR.2 v28.3,18
  other vias: 13.8,33.3 14.5,33.3 14.31,14.8 14.31,15.5 12.81,14.8
  pour Top/Horz (no thermals): 13.3,14.1 13.8,14.1 14.5,14.8 14.5,15.8 12.6,15.8 12.6,14.8
  pour Top/Horz (no thermals): 13.6,32.9 14.6,32.9 14.9,33.2 14.9,34.3 14.6,34.6 13.8,34.6 13.5,34.3 13.2,34.3 13.2,33.3
  pour Route15: -0.4,65.2 38,65.2 38,3.2 -0.4,3.2
  cutout Route15: 19.4,62.7 22.5,62.7 22.8,62.7 23.8,61.7 23.8,49.4 23.4,49 23.2,48.8 19.8,48.8 18.2,50.4 18.2,61.7 19.2,62.7
VIN  (via drill 0.3)
  Top/Horz 0.6: v10.95,6.48 D1.A
  Bottom/Vert 0.2: 10.25,3.35 10.25,3.63 9.75,3.13 J2.74 | 10.25,3.35 | J2.72 10.25,3.35
  Bottom/Vert 0.6: 10.25,3.35 10.95,4.05 v10.95,6.48
ZED_!RESET!  (via drill 0.3)
  Top/Horz 0.11: U8.49 v26.1,44.4 | U7.17 7.95,30.15 v8.4,29.7
  Route2 0.11: v8.4,29.7 8.4,31.9 9.7,33.2 9.7,34.2 v10,34.5
  Bottom/Vert 0.11: v10,34.5 10.79,35.29 23.96,35.29 24.49,35.81 24.49,42.2 26.1,43.81 v26.1,44.4
ZED_!SAFEBOOT!
  Top/Horz 0.11: J11.1 U8.50
ZED_ANT_!SHORT!  (via drill 0.3)
  Top/Horz 0.11: R17.2 U6.4
  Top/Horz 0.2: U6.4 v15.7,55.3 | v15.7,55.3 | U8.6 v16.65,53.35
  Top/Horz 0.35: L1.1 C5.1 17.96,56.21 R17.2
  Bottom/Vert 0.2: v15.7,55.3 15.7,54.3 v16.65,53.35
ZED_ANT_DETECT  (via drill 0.3)
  Top/Horz 0.2: U6.1 v14.21,58.05 | U8.4 v18.85,52.31
  Bottom/Vert 0.2: v14.21,58.05 16.2,56.06 16.2,54.96 v18.85,52.31
ZED_ANT_OFF  (via drill 0.3)
  Top/Horz 0.11: U8.5 17.75,52.85 16.7,53.9 14.6,53.9 | v12.1,54.5 13.6,54.5 14.2,53.9 14.6,53.9 | Q1.3 14.6,53.9
  Bottom/Vert 0.11: v12.1,54.5 ANTSUP.2
ZED_DSEL  (via drill 0.3)
  Top/Horz 0.11: U8.47 v26.1,42.2
  Top/Horz 0.2: U11.2 v23.7,28.8 | U4.12 v17.86,24.14 | U4.6 v21.68,23.27 21.07,23.27 20.41,22.61 U4.5 | v17,24.6 16.59,25 U4.13
  Route2 0.2: v23.7,28.8 23.7,25.3 v21.68,23.27 18.73,23.27 v17.86,24.14 17.46,24.14 v17,24.6
  Bottom/Vert 0.11: v26.1,42.2 27.35,40.95 27.35,35.45 23.7,31.8 v23.7,28.8 23.7,28.1 24.4,27.4 DSEL.2
ZED_EXTINT  (via drill 0.3)
  Top/Horz 0.11: U8.51 v26.1,46.6 | U7.16 7.45,30.05 v7.7,29.8
  Route2 0.11: v7.7,29.8 7.7,31.5 9.4,33.2 v9.4,34.5
  Bottom/Vert 0.11: v9.4,34.5 10.4,35.5 23.88,35.5 24.28,35.9 24.28,41.6 22.9,42.98 22.9,43.67 25.83,46.6 v26.1,46.6
ZED_GEO_STAT
  Top/Horz 0.11: U7.9 5.45,34.15 5.2,34.4 4.77,34.4 2.9,36.27 2.9,43.4 3.3,43.8 3.3,45 3.8,45.5 U8.19
ZED_PPS  (via drill 0.3)
  Top/Horz 0.11: U8.53 v26.2,48.8 | U7.2 9.45,33.55 9.9,34 10.2,34 v10.6,34.4 | v1.7,55.6 1.7,61.78 D6.A
  Bottom/Vert 0.11: v10.6,34.4 11.28,35.08 24.05,35.08 24.7,35.73 24.7,42 26.48,43.78 26.48,44.57 25.9,45.15 25.9,45.86 26.48,46.44 26.48,48.52 v26.2,48.8 23.7,46.3 3.1,46.3 1.7,47.7 v1.7,55.6
ZED_RTK_STAT  (via drill 0.3)
  Top/Horz 0.11: U7.8 5.95,34.25 5.5,34.7 4.78,34.7 3.11,36.36 3.11,43.31 3.51,43.71 3.51,44.01 3.9,44.4 U8.20 6.14,44.4 6.98,45.24 6.98,45.56 6.5,46.04 v6.5,55.6
  Bottom/Vert 0.11: v6.5,55.6 RTKLED.1
ZED_RX2/RTCM  (via drill 0.3)
  Top/Horz 0.11: U7.13 5.95,30.15 v6.09,30.01 | U8.26 4.3,37.8 v3.6,37.1
  Bottom/Vert 0.11: v6.09,30.01 6.09,30.76 3.6,33.25 v3.6,37.1
ZED_RX/PICO  (via drill 0.3)
  Top/Horz 0.11: U8.43 v26.1,37.8 | v19.1,25.3 19.1,26.36 U4.11 | v7.05,25.4 7.05,26.39 U5.11
  Bottom/Vert 0.11: v26.1,37.8 26.71,37.19 26.71,35.71 22.38,31.38 22.38,25.38 20.7,23.7 | 20.7,23.7 20.01,23.01 15.74,23.01 14.94,22.21 9.19,22.21 7.05,24.35 v7.05,25.4 | v19.1,25.3 20.7,23.7
ZED_SCL/SCK  (via drill 0.3)
  Top/Horz 0.11: U8.45 v26.1,40 | v19.15,22 v19.14,22 U4.4 | v7.04,22.2 U5.4
  Bottom/Vert 0.11: v26.1,40 27.14,38.97 27.14,35.54 22.8,31.2 22.8,25.2 20.19,22.59 19.74,22.59 v19.15,22 15.87,22 15.44,21.57 9.21,21.57 8.58,22.2 v7.04,22.2
ZED_SDA/!CS!  (via drill 0.3)
  Top/Horz 0.11: U8.44 v26.1,38.9 | v15.3,22 15.3,20.82 U4.1 | v3.2,22.1 3.2,20.82 U5.1
  Bottom/Vert 0.11: v26.1,38.9 26.92,38.08 26.92,35.62 22.59,31.29 22.59,25.29 20.1,22.8 16.1,22.8 v15.3,22 9.1,22 8.4,22.7 3.8,22.7 v3.2,22.1
ZED_TX2/RTCM
  Top/Horz 0.11: U8.27 4.2,36.7 3.9,36.4 3.9,35.88 4.78,35 6.5,35 6.95,34.55 U7.6
ZED_TX/POCI  (via drill 0.3)
  Top/Horz 0.11: U8.42 v26.1,36.7 | v21.94,28 22.44,27.5 22.64,27.5 22.95,27.2 U4.8 | U5.8 v11.55,26.4
  Bottom/Vert 0.11: v26.1,36.7 26.4,36.4 26.4,35.7 22.14,31.44 22.14,28.2 v21.94,28 20.34,26.4 v11.55,26.4
ZED_TX_READY  (via drill 0.3)
  Top/Horz 0.11: U8.46 v26.1,41.1 | U7.5 v7.45,34.4
  Route2 0.11: v26.1,41.1 26.1,40.9 23.5,38.3 23.5,36.1 v23.3,35.9
  Bottom/Vert 0.11: v23.3,35.9 8.2,35.9 7.45,35.15 v7.45,34.4
ZED_USB_DET
  Top/Horz 0.152: U1.2 R18.1
ZED_USB_N
  Top/Horz 0.2: U8.39 19.95,34.69 21.24,33.4 28.87,33.4 30.1,34.63 30.1,54.1 R10.2
ZED_USB_P
  Top/Horz 0.2: U8.40 21.05,34.69 21.94,33.8 28.7,33.8 29.7,34.8 29.7,54.1 R9.2

### Text on the board
Bottom/Vert: v10
Measures: Dimensions are in mm
tDocu: Board Thickness is 0.8mm | 4-Layer | Beveled Edge | ENIG Finish | A. Brudner